# EasyEDA Pro project ovo.epro, board 114514
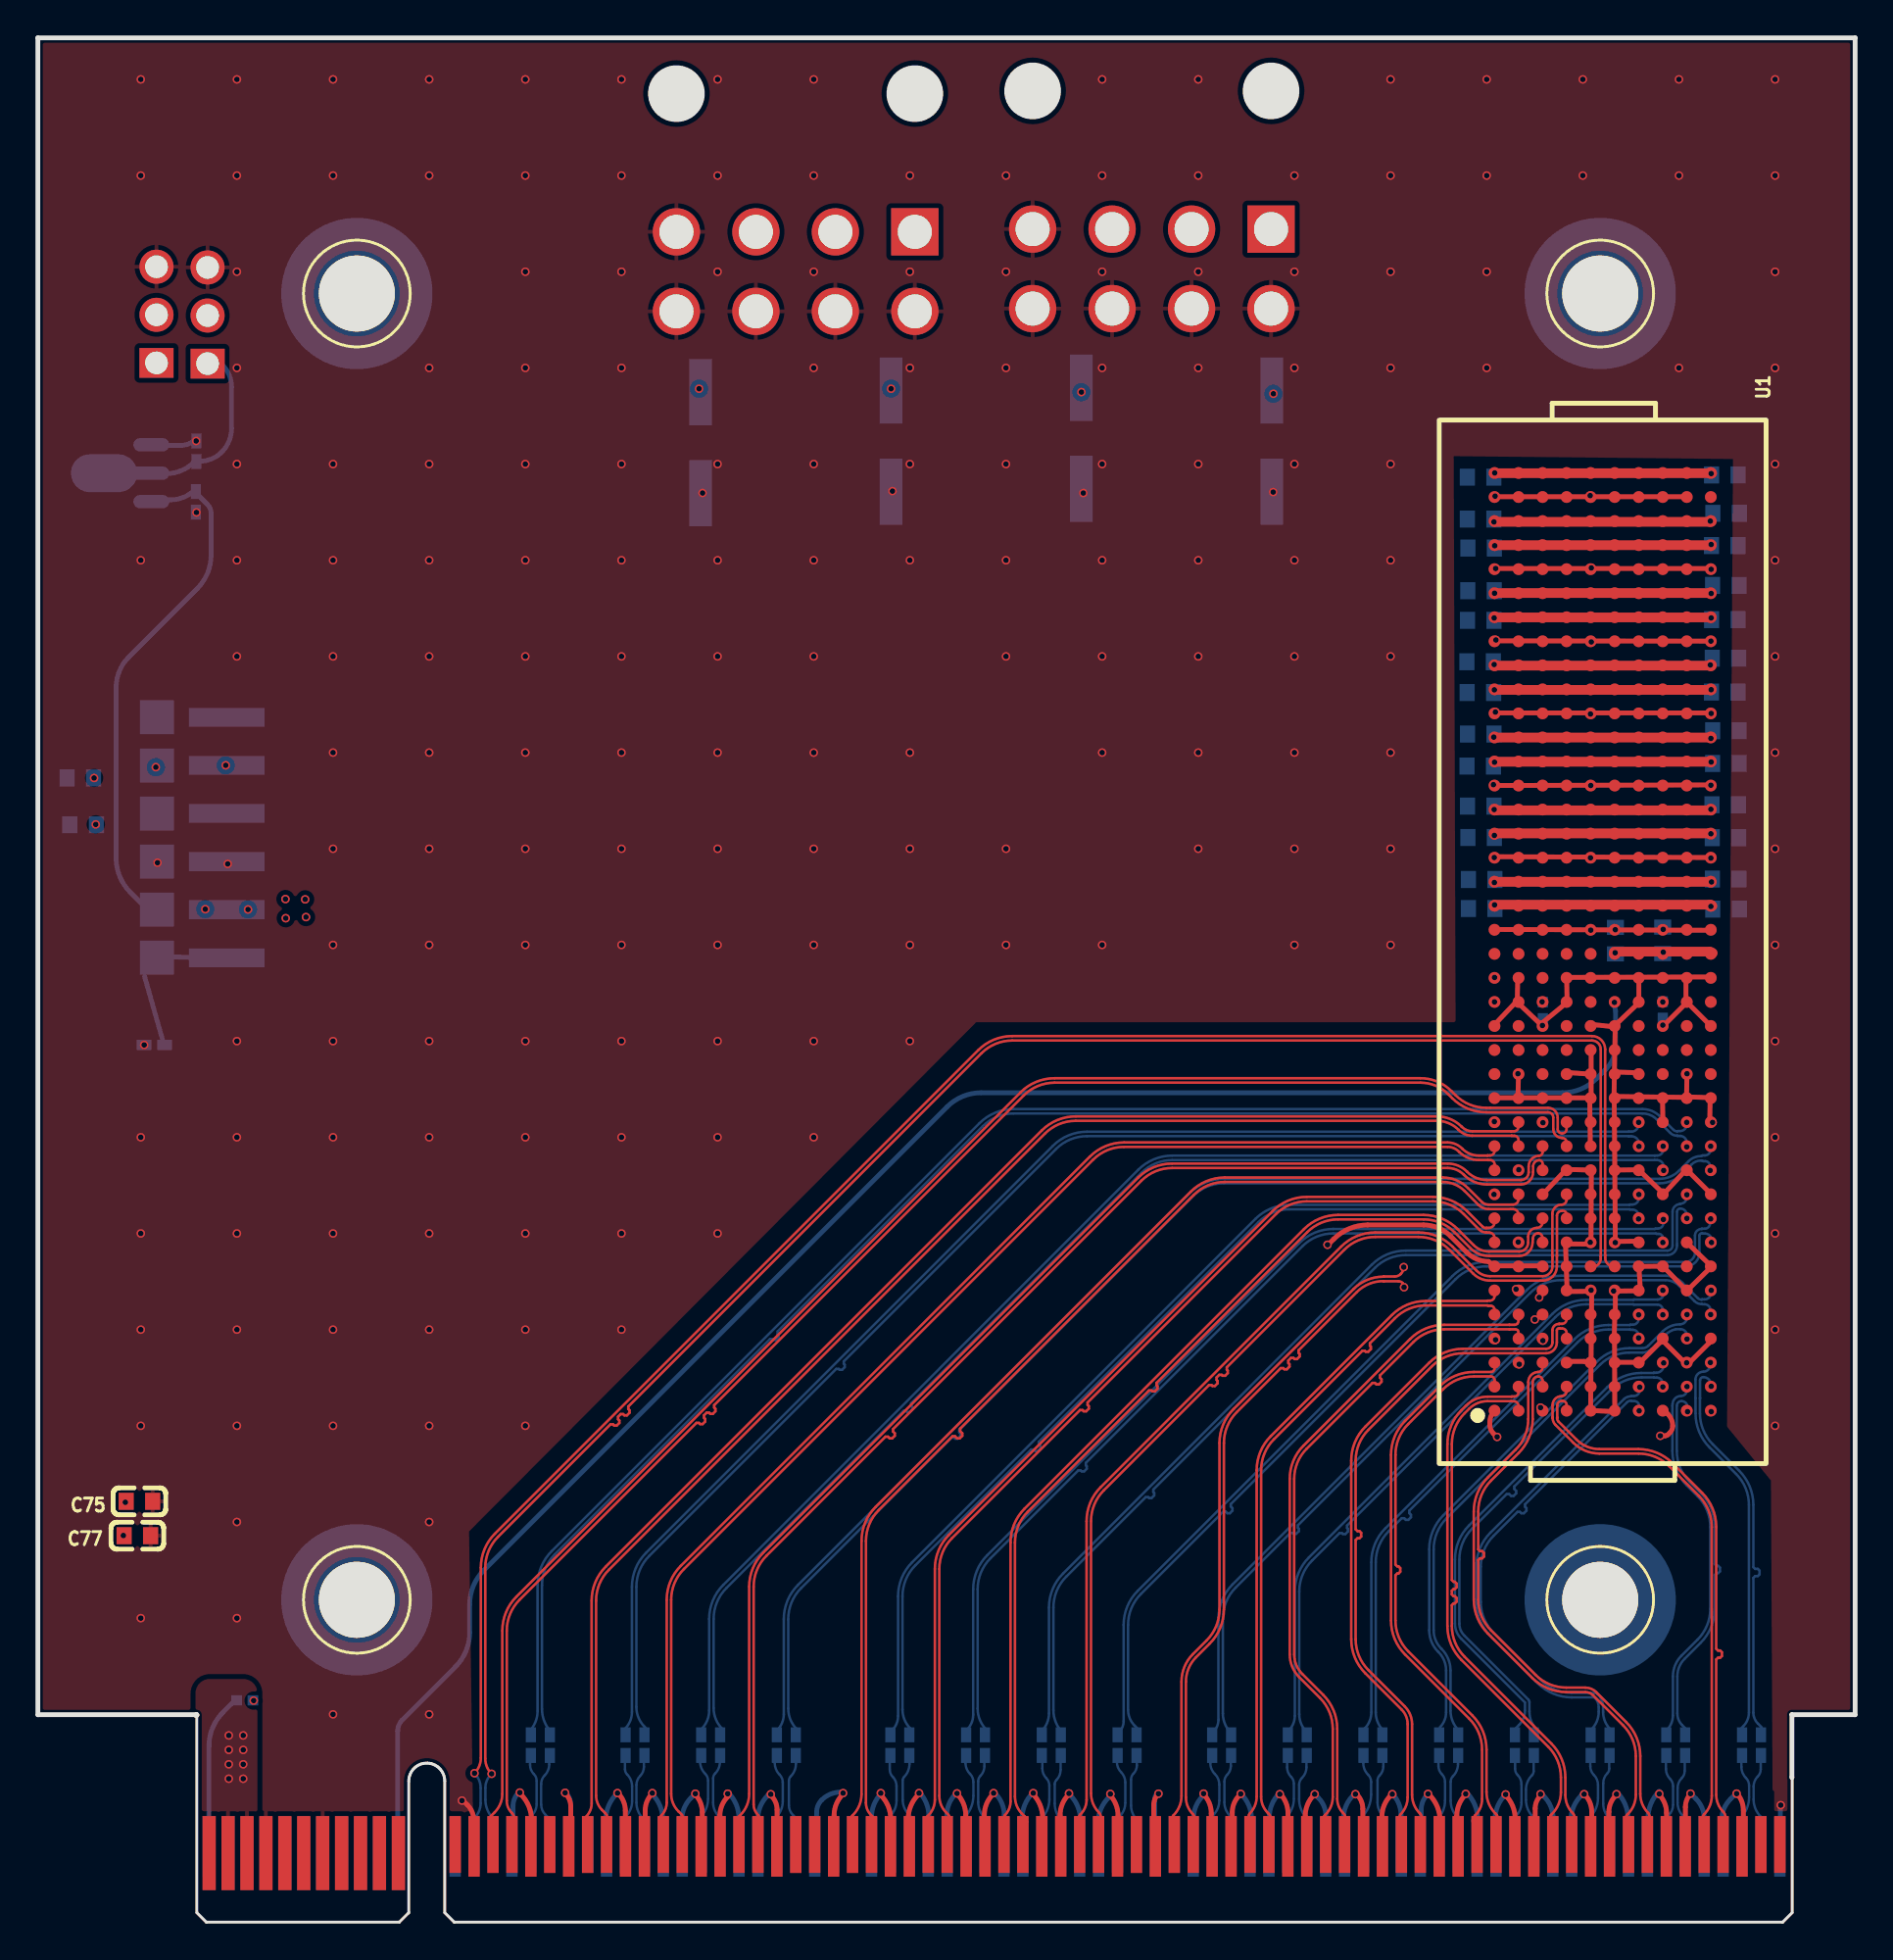
[diagram p0: board, top side]
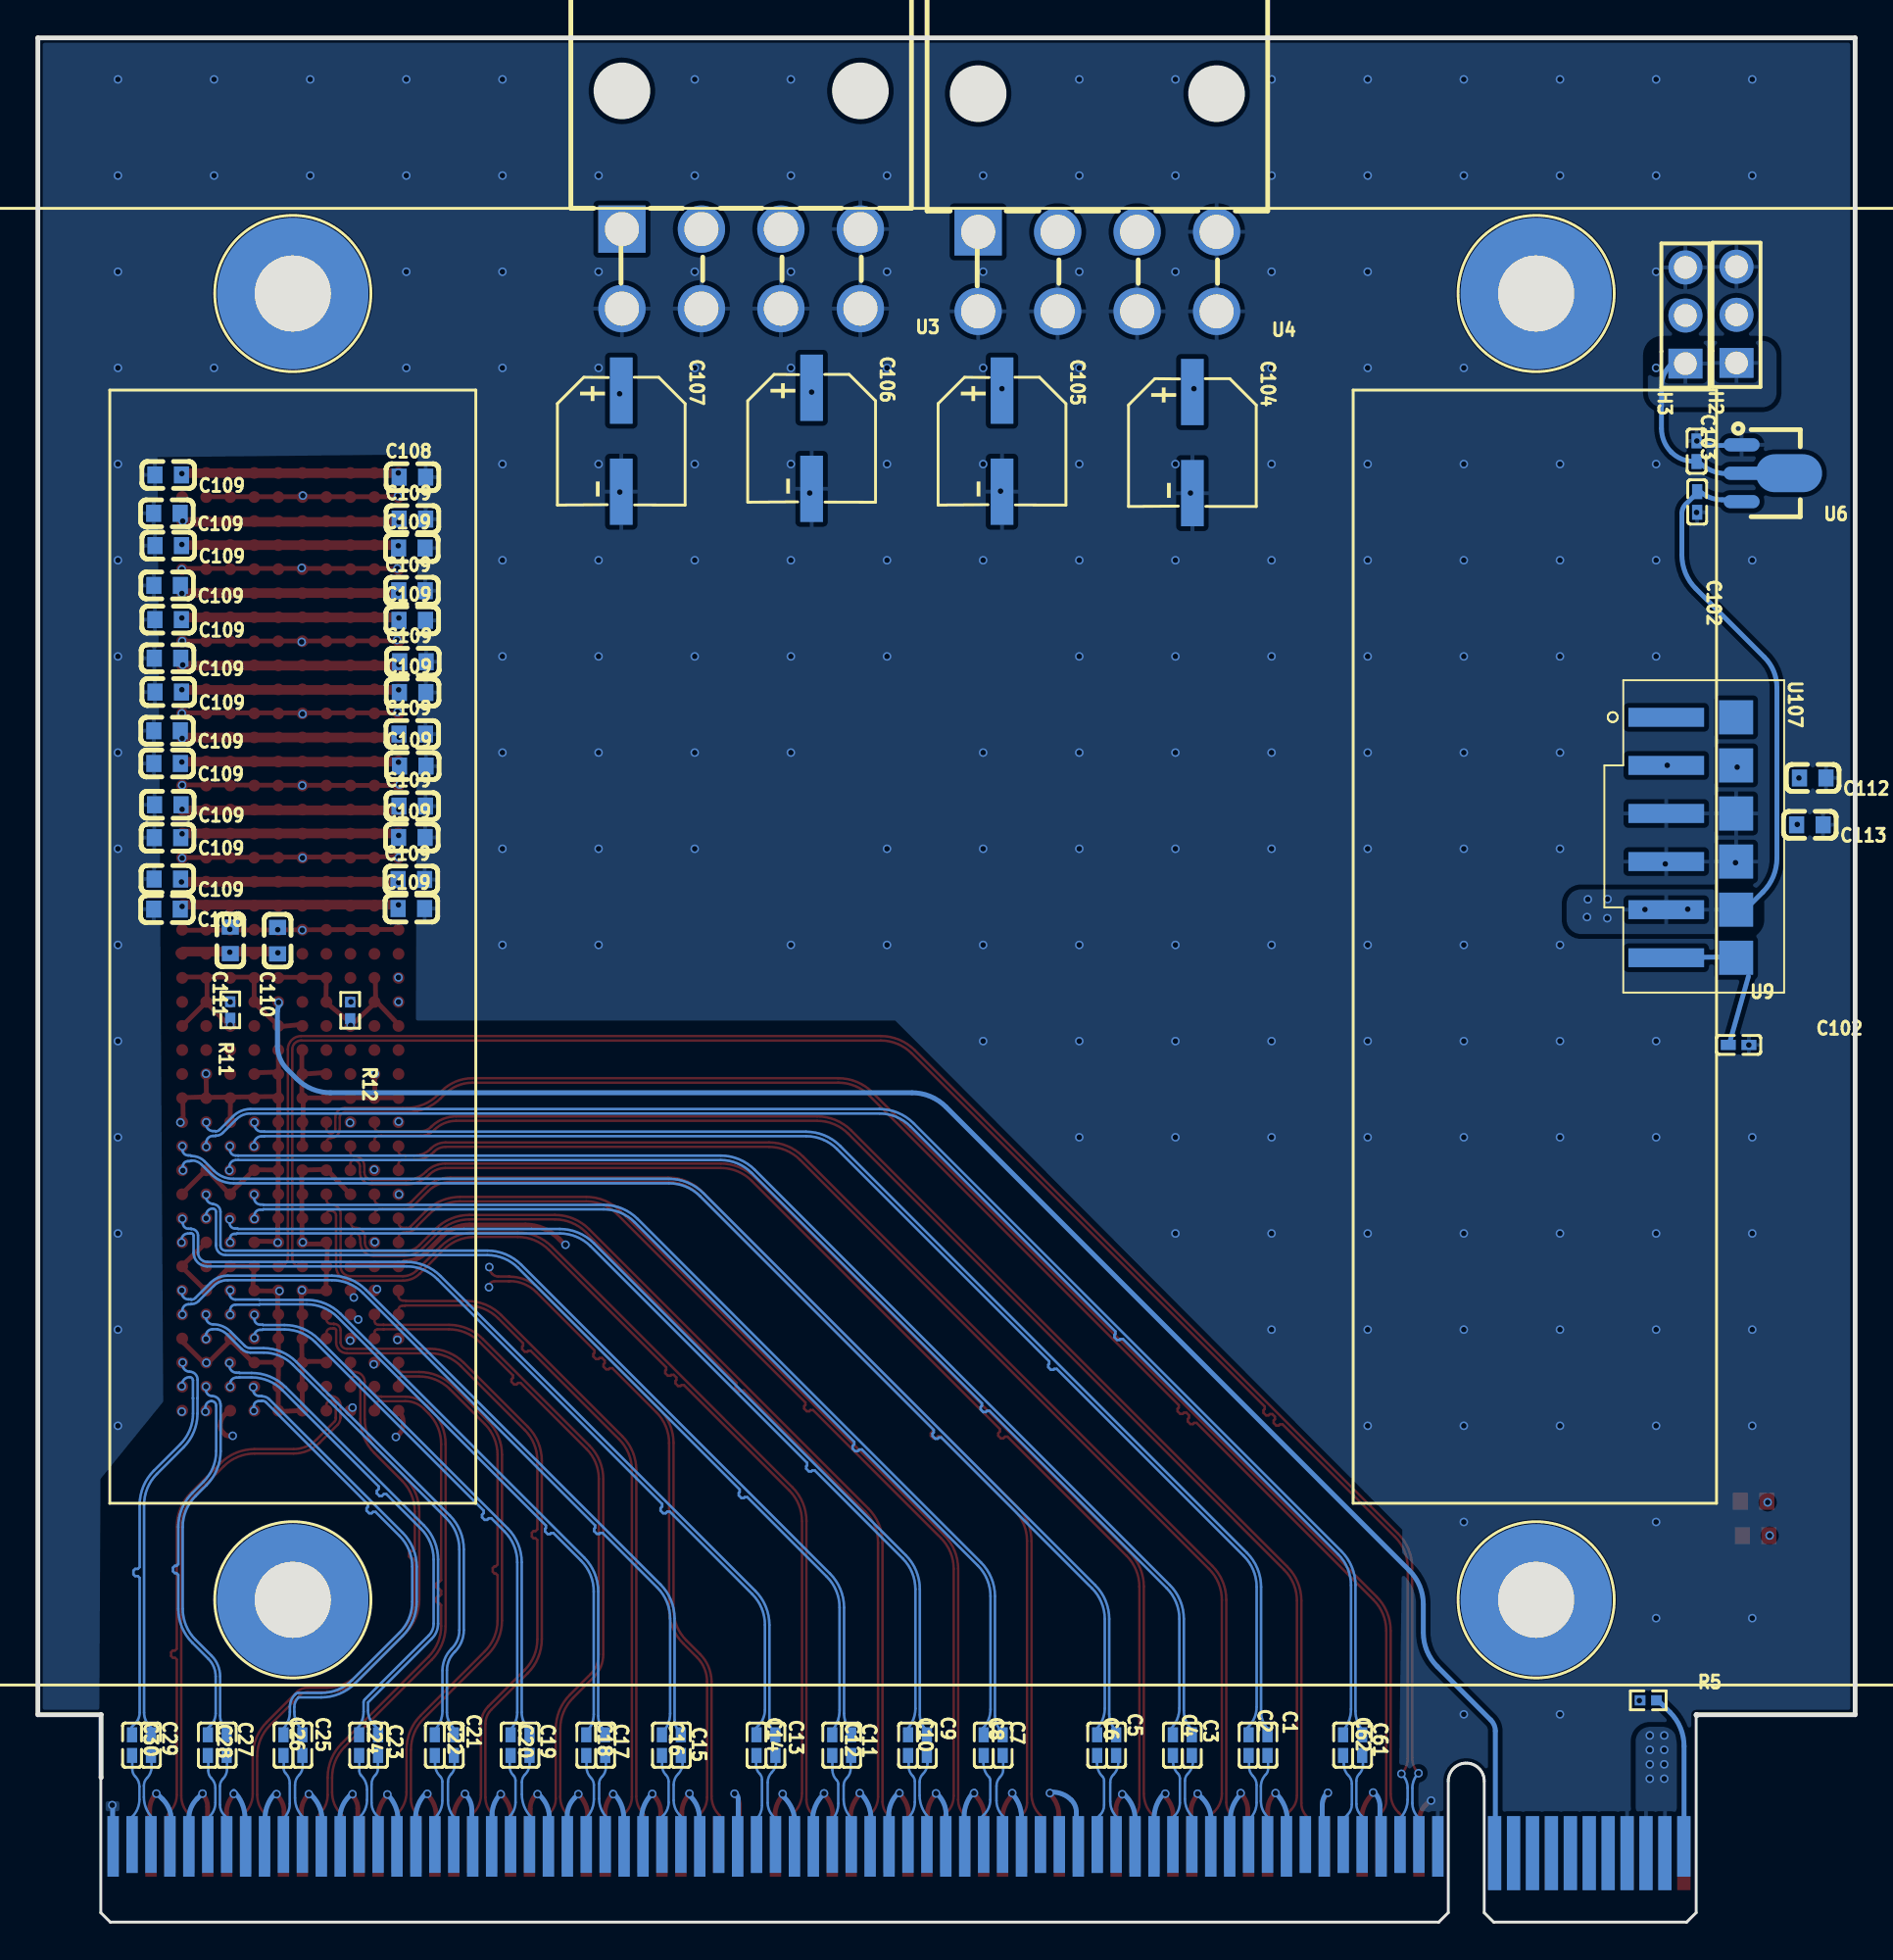
[diagram p1: board, bottom side, seen from below]

Outline 96.03 x 99.53 mm; copper layers: Top Layer, Inner1, Inner2, Inner3, 内层4, Bottom Layer. Coordinates in mm from the lower left corner of the outline.
Outline path: 8.34,10.96 8.34,10.93 8.4,10.93 8.4,10.96 0,10.96 0,99.53 96.03,99.53 96.03,10.96 92.69,10.96 ; 92.69,10.96 92.69,10.96 ; 92.69,10.96 92.69,7.65 92.69,7.65
Stack: Top Layer 0.035mm / Dielectric1 1.51mm FR4 er 4.5 / Inner1 0.035mm / Dielectric2 0.274mm FR4 er 4.5 / Inner2 0.035mm / Dielectric3 0.274mm PP er 4.5 / Inner3 0.035mm / Dielectric4 0.274mm PP er 4.5 / 内层4 0.035mm / Dielectric5 0.274mm PP er 4.5 / Bottom Layer 0.035mm

## Design rules (mm)
net CLK+: DP1
net CLK-: DP1
net RX0-: DP2
net RX15+: DP17
net RX15-: DP17
net RX11-: DP13
net RX7-: DP9
net RX0+: DP2
net RX7+: DP9
net RX11+: DP13
net RX14-: DP16
net RX14+: DP16
net RX6-: DP8
net RX3+: DP5
net RX3-: DP5
net RX6+: DP8
net RX10-: DP12
net RX4-: DP6
net RX13+: DP15
net RX13-: DP15
net RX1-: DP3
net RX1+: DP3
net RX4+: DP6
net RX10+: DP12
net RX2+: DP4
net RX2-: DP4
net RX9-: DP11
net RX12+: DP14
net RX9+: DP11
net RX12-: DP14
net RX5-: DP7
net RX5+: DP7
net RX8+: DP10
net RX8-: DP10
net TX8-: DP26
net TX3+: DP21
net TX15+: DP33
net TX7+: DP25
net TX8+: DP26
net TX3-: DP21
net TX7-: DP25
net TX15-: DP33
net TX0-: DP18
net TX11+: DP29
net TX14-: DP32
net TX0+: DP18
net TX6-: DP24
net TX6+: DP24
net TX11-: DP29
net TX14+: DP32
net TX2-: DP20
net TX2+: DP20
net TX5-: DP23
net TX12+: DP30
net TX12-: DP30
net TX9+: DP27
net TX9-: DP27
net TX5+: DP23
net TX1-: DP19
net TX1+: DP19
net TX4-: DP22
net TX10+: DP28
net TX13-: DP31
net TX4+: DP22
net TX10-: DP28
net TX13+: DP31
template: 自定义配置
spacing copperThickness1oz (default): track to track 0.102, other pairs 0.102 to 0.3
spacing copperThickness2oz: track to track 0.203, other pairs 0.152 to 0.3
track width copperThickness1oz (default): min 0.127, default 0.254, max 2.54
track width copperThickness2oz: min 0.203, default 0.254, max 2.54
differential pair differentialPair (default): width min 0.127, default 0.132, max 2.54; gap min 0.102, default 0.102
via viaSize (default): diameter min 0.254, default 0.45, max 10; hole min 0.254, default 0.3, max 6.3

## Placement (name value [footprint] x y rotation side)
C1  220nF  [C0402]  31.05 9.35 90 bottom
C2  220nF  [C0402]  32.05 9.35 90 bottom
C3  220nF  [C0402]  35.05 9.35 90 bottom
C4  220nF  [C0402]  36.05 9.35 90 bottom
C5  220nF  [C0402]  39.05 9.35 90 bottom
C6  220nF  [C0402]  40.05 9.35 90 bottom
C7  220nF  [C0402]  45.05 9.35 90 bottom
C8  220nF  [C0402]  46.05 9.35 90 bottom
C9  220nF  [C0402]  49.05 9.35 90 bottom
C10  220nF  [C0402]  50.05 9.35 90 bottom
C11  220nF  [C0402]  53.05 9.35 90 bottom
C12  220nF  [C0402]  54.05 9.35 90 bottom
C13  220nF  [C0402]  57.06 9.35 90 bottom
C14  220nF  [C0402]  58.06 9.35 90 bottom
C15  220nF  [C0402]  62.05 9.35 90 bottom
C16  220nF  [C0402]  63.05 9.35 90 bottom
C17  220nF  [C0402]  66.05 9.35 90 bottom
C18  220nF  [C0402]  67.05 9.35 90 bottom
C19  220nF  [C0402]  70.05 9.35 90 bottom
C20  220nF  [C0402]  71.05 9.35 90 bottom
C21  220nF  [C0402]  74.05 9.35 90 bottom
C22  220nF  [C0402]  75.05 9.35 90 bottom
C23  220nF  [C0402]  78.05 9.35 90 bottom
C24  220nF  [C0402]  79.05 9.35 90 bottom
C25  220nF  [C0402]  82.05 9.35 90 bottom
C26  220nF  [C0402]  83.05 9.35 90 bottom
C27  220nF  [C0402]  86.05 9.35 90 bottom
C28  220nF  [C0402]  87.05 9.35 90 bottom
C29  220nF  [C0402]  90.05 9.35 90 bottom
C30  220nF  [C0402]  91.05 9.35 90 bottom
C61  220nF  [C0402]  26.05 9.35 90 bottom
C62  220nF  [C0402]  27.06 9.35 90 bottom
C75  10uF  [C0603]  5.37 22.23 0 top
C77  10uF  [C0603]  5.26 20.41 0 top
C102  -  [C0402]  6.16 46.34 0 bottom
C102#2  -  [C0402]  8.35 75.02 90 bottom
C103  100nF  [C0402]  8.38 77.7 270 bottom
C104  470uF  [CAP-SMD_BD6.3-L6.6-W6.6-LS7.6-RD]  35.02 78.15 270 bottom
C105  470uF  [CAP-SMD_BD6.3-L6.6-W6.6-LS7.6-RD]  45.08 78.23 270 bottom
C106  470uF  [CAP-SMD_BD6.3-L6.6-W6.6-LS7.6-RD]  55.14 78.38 270 bottom
C107  470uF  [CAP-SMD_BD6.3-L6.6-W6.6-LS7.6-RD]  65.2 78.23 270 bottom
C108  -  [C0603]  89.21 53.51 0 bottom
C108#2  -  [C0603]  76.24 76.33 180 bottom
C109  -  [C0603]  89.14 76.44 0 bottom
C109#2  -  [C0603]  89.21 74.42 0 bottom
C109#3  -  [C0603]  89.14 72.71 0 bottom
C109#4  -  [C0603]  89.2 70.61 0 bottom
C109#5  -  [C0603]  89.14 68.8 0 bottom
C109#6  -  [C0603]  89.18 66.76 0 bottom
C109#7  -  [C0603]  89.14 64.97 0 bottom
C109#8  -  [C0603]  89.2 62.93 0 bottom
C109#9  -  [C0603]  89.2 61.2 0 bottom
C109#10  -  [C0603]  89.16 59.02 0 bottom
C109#11  -  [C0603]  89.18 57.28 0 bottom
C109#12  -  [C0603]  89.19 55.1 0 bottom
C109#13  -  [C0603]  76.24 74.11 180 bottom
C109#14  -  [C0603]  76.27 72.58 180 bottom
C109#15  -  [C0603]  76.26 70.33 180 bottom
C109#16  -  [C0603]  76.25 68.76 180 bottom
C109#17  -  [C0603]  76.21 66.58 180 bottom
C109#18  -  [C0603]  76.23 64.95 180 bottom
C109#19  -  [C0603]  76.25 62.76 180 bottom
C109#20  -  [C0603]  76.22 61.07 180 bottom
C109#21  -  [C0603]  76.25 58.95 180 bottom
C109#22  -  [C0603]  76.27 57.29 180 bottom
C109#23  -  [C0603]  76.29 55.07 180 bottom
C109#24  -  [C0603]  76.29 53.54 180 bottom
C110  100nF  [C0603]  83.36 51.84 90 bottom
C111  100nF  [C0603]  85.86 51.86 90 bottom
C112  100nF  [C0603]  2.24 60.44 0 bottom
C113  100nF  [C0603]  2.39 57.96 0 bottom
F1  -  [Gold Finger CEM GEN5x16]  50.91 12.95 0 top
H2  2.54-1*3P针  [HDR-TH_3P-P2.54-V-M-1]  6.27 84.9 90 bottom
H3  2.54-1*3P针  [HDR-TH_3P-P2.54-V-M-1]  8.97 84.86 90 bottom
R5  0Ω  [R0402]  10.93 11.72 0 bottom
R11  100Ω  [R0402]  85.86 48.19 270 bottom
R12  100Ω  [R0402]  79.53 48.16 270 bottom
U1  84740-102LF  [CONN-SMD_400P-P1.27_84740-002LF]  82.69 51.78 270 top
U3  X9357WR-2x04EH-LPSW  [CONN-TH_8P-P4.20_XKB_X9357WR-2X04EH-N2SW]  58.87 87.33 0 bottom
U4  X9357WR-2x04EH-LPSW  [CONN-TH_8P-P4.20_XKB_X9357WR-2X04EH-N2SW]  40.04 87.18 0 bottom
U6  AMS1117-1.8V  [SOT-89-3_L4.5-W2.5-P1.50-LS4.1-BR]  4.75 76.53 0 bottom
U9  -  [module_sxm2]  49.71 51.53 0 bottom
U107  U107  [ZXDN10S1205SAW-NEWs]  8.83 58.56 270 bottom

## Footprints (pads in the part's own frame, mm; a bottom-side part is the same pattern mirrored in y, then rotated)
C0402
  rect 0.79x0.54 smd: 1(-0.545,0) 2(0.545,0)
C0603
  rect 0.8x0.9 smd: 1(-0.7,0) 2(0.7,0)
CAP-SMD_BD6.3-L6.6-W6.6-LS7.6-RD
  rect 3.5x1.2 smd: 1(-2.67,0) 2(2.67,0)
CONN-SMD_400P-P1.27_84740-002LF
  round 0.623 smd: A1(24.765,-5.715) A2(23.495,-5.715) A3(22.225,-5.715) A4(20.955,-5.715) A5(19.685,-5.715) A6(18.415,-5.715) A7(17.145,-5.715) A8(15.875,-5.715) A9(14.605,-5.715) A10(13.335,-5.715) A11(12.065,-5.715) A12(10.795,-5.715) A13(9.525,-5.715) A14(8.255,-5.715) A15(6.985,-5.715) A16(5.715,-5.715) A17(4.445,-5.715) A18(3.175,-5.715) A19(1.905,-5.715) A20(0.635,-5.715) A21(-0.635,-5.715) A22(-1.905,-5.715) A23(-3.175,-5.715) A24(-4.445,-5.715) A25(-5.715,-5.715) A26(-6.985,-5.715) A27(-8.255,-5.715) A28(-9.525,-5.715) A29(-10.795,-5.715) A30(-12.065,-5.715) A31(-13.335,-5.715) A32(-14.605,-5.715) A33(-15.875,-5.715) A34(-17.145,-5.715) A35(-18.415,-5.715) A36(-19.685,-5.715) A37(-20.955,-5.715) A38(-22.225,-5.715) A39(-23.495,-5.715) A40(-24.765,-5.715) B1(24.765,-4.445) B2(23.495,-4.445) B3(22.225,-4.445) B4(20.955,-4.445) B5(19.685,-4.445) B6(18.415,-4.445) B7(17.145,-4.445) B8(15.875,-4.445) B9(14.605,-4.445) B10(13.335,-4.445) B11(12.065,-4.445) B12(10.795,-4.445) B13(9.525,-4.445) B14(8.255,-4.445) B15(6.985,-4.445) B16(5.715,-4.445) B17(4.445,-4.445) B18(3.175,-4.445) B19(1.905,-4.445) B20(0.635,-4.445) B21(-0.635,-4.445) B22(-1.905,-4.445) B23(-3.175,-4.445) B24(-4.445,-4.445) B25(-5.715,-4.445) B26(-6.985,-4.445) B27(-8.255,-4.445) B28(-9.525,-4.445) B29(-10.795,-4.445) B30(-12.065,-4.445) B31(-13.335,-4.445) B32(-14.605,-4.445) B33(-15.875,-4.445) B34(-17.145,-4.445) B35(-18.415,-4.445) B36(-19.685,-4.445) B37(-20.955,-4.445) B38(-22.225,-4.445) B39(-23.495,-4.445) B40(-24.765,-4.445) C1(24.765,-3.175) C2(23.495,-3.175) C3(22.225,-3.175) C4(20.955,-3.175) C5(19.685,-3.175) C6(18.415,-3.175) C7(17.145,-3.175) C8(15.875,-3.175) C9(14.605,-3.175) C10(13.335,-3.175) C11(12.065,-3.175) C12(10.795,-3.175) C13(9.525,-3.175) C14(8.255,-3.175) C15(6.985,-3.175) C16(5.715,-3.175) C17(4.445,-3.175) C18(3.175,-3.175) C19(1.905,-3.175) C20(0.635,-3.175) C21(-0.635,-3.175) C22(-1.905,-3.175) C23(-3.175,-3.175) C24(-4.445,-3.175) C25(-5.715,-3.175) C26(-6.985,-3.175) C27(-8.255,-3.175) C28(-9.525,-3.175) C29(-10.795,-3.175) C30(-12.065,-3.175) C31(-13.335,-3.175) C32(-14.605,-3.175) C33(-15.875,-3.175) C34(-17.145,-3.175) C35(-18.415,-3.175) C36(-19.685,-3.175) C37(-20.955,-3.175) C38(-22.225,-3.175) C39(-23.495,-3.175) C40(-24.765,-3.175) D1(24.765,-1.905) D2(23.495,-1.905) D3(22.225,-1.905) D4(20.955,-1.905) D5(19.685,-1.905) D6(18.415,-1.905) D7(17.145,-1.905) D8(15.875,-1.905) D9(14.605,-1.905) D10(13.335,-1.905) D11(12.065,-1.905) D12(10.795,-1.905) D13(9.525,-1.905) D14(8.255,-1.905) D15(6.985,-1.905) D16(5.715,-1.905) D17(4.445,-1.905) D18(3.175,-1.905) D19(1.905,-1.905) D20(0.635,-1.905) D21(-0.635,-1.905) D22(-1.905,-1.905) D23(-3.175,-1.905) D24(-4.445,-1.905) D25(-5.715,-1.905) D26(-6.985,-1.905) D27(-8.255,-1.905) D28(-9.525,-1.905) D29(-10.795,-1.905) D30(-12.065,-1.905) D31(-13.335,-1.905) D32(-14.605,-1.905) D33(-15.875,-1.905) D34(-17.145,-1.905) D35(-18.415,-1.905) D36(-19.685,-1.905) D37(-20.955,-1.905) D38(-22.225,-1.905) D39(-23.495,-1.905) D40(-24.765,-1.905) E1(24.765,-0.635) E2(23.495,-0.635) E3(22.225,-0.635) E4(20.955,-0.635) E5(19.685,-0.635) E6(18.415,-0.635) E7(17.145,-0.635) E8(15.875,-0.635) E9(14.605,-0.635) E10(13.335,-0.635) E11(12.065,-0.635) E12(10.795,-0.635) E13(9.525,-0.635) E14(8.255,-0.635) E15(6.985,-0.635) E16(5.715,-0.635) E17(4.445,-0.635) E18(3.175,-0.635) E19(1.905,-0.635) E20(0.635,-0.635) E21(-0.635,-0.635) E22(-1.905,-0.635) E23(-3.175,-0.635) E24(-4.445,-0.635) E25(-5.715,-0.635) E26(-6.985,-0.635) E27(-8.255,-0.635) E28(-9.525,-0.635) E29(-10.795,-0.635) E30(-12.065,-0.635) E31(-13.335,-0.635) E32(-14.605,-0.635) E33(-15.875,-0.635) E34(-17.145,-0.635) E35(-18.415,-0.635) E36(-19.685,-0.635) E37(-20.955,-0.635) E38(-22.225,-0.635) E39(-23.495,-0.635) E40(-24.765,-0.635) F1(24.765,0.635) F2(23.495,0.635) F3(22.225,0.635) F4(20.955,0.635) F5(19.685,0.635) F6(18.415,0.635) F7(17.145,0.635) F8(15.875,0.635) F9(14.605,0.635) F10(13.335,0.635) F11(12.065,0.635) F12(10.795,0.635) F13(9.525,0.635) F14(8.255,0.635) F15(6.985,0.635) F16(5.715,0.635) F17(4.445,0.635) F18(3.175,0.635) F19(1.905,0.635) F20(0.635,0.635) F21(-0.635,0.635) F22(-1.905,0.635) F23(-3.175,0.635) F24(-4.445,0.635) F25(-5.715,0.635) F26(-6.985,0.635) F27(-8.255,0.635) F28(-9.525,0.635) F29(-10.795,0.635) F30(-12.065,0.635) F31(-13.335,0.635) F32(-14.605,0.635) F33(-15.875,0.635) F34(-17.145,0.635) F35(-18.415,0.635) F36(-19.685,0.635) F37(-20.955,0.635) F38(-22.225,0.635) F39(-23.495,0.635) F40(-24.765,0.635) G1(24.765,1.905) G2(23.495,1.905) G3(22.225,1.905) G4(20.955,1.905) G5(19.685,1.905) G6(18.415,1.905) G7(17.145,1.905) G8(15.875,1.905) G9(14.605,1.905) G10(13.335,1.905) G11(12.065,1.905) G12(10.795,1.905) G13(9.525,1.905) G14(8.255,1.905) G15(6.985,1.905) G16(5.715,1.905) G17(4.445,1.905) G18(3.175,1.905) G19(1.905,1.905) G20(0.635,1.905) G21(-0.635,1.905) G22(-1.905,1.905) G23(-3.175,1.905) G24(-4.445,1.905) G25(-5.715,1.905) G26(-6.985,1.905) G27(-8.255,1.905) G28(-9.525,1.905) G29(-10.795,1.905) G30(-12.065,1.905) G31(-13.335,1.905) G32(-14.605,1.905) G33(-15.875,1.905) G34(-17.145,1.905) G35(-18.415,1.905) G36(-19.685,1.905) G37(-20.955,1.905) G38(-22.225,1.905) G39(-23.495,1.905) G40(-24.765,1.905) H1(24.765,3.175) H2(23.495,3.175) H3(22.225,3.175) H4(20.955,3.175) H5(19.685,3.175) H6(18.415,3.175) H7(17.145,3.175) H8(15.875,3.175) H9(14.605,3.175) H10(13.335,3.175) H11(12.065,3.175) H12(10.795,3.175) H13(9.525,3.175) H14(8.255,3.175) H15(6.985,3.175) H16(5.715,3.175) H17(4.445,3.175) H18(3.175,3.175) H19(1.905,3.175) H20(0.635,3.175) H21(-0.635,3.175) H22(-1.905,3.175) H23(-3.175,3.175) H24(-4.445,3.175) H25(-5.715,3.175) H26(-6.985,3.175) H27(-8.255,3.175) H28(-9.525,3.175) H29(-10.795,3.175) H30(-12.065,3.175) H31(-13.335,3.175) H32(-14.605,3.175) H33(-15.875,3.175) H34(-17.145,3.175) H35(-18.415,3.175) H36(-19.685,3.175) H37(-20.955,3.175) H38(-22.225,3.175) H39(-23.495,3.175) H40(-24.765,3.175) J1(24.765,4.445) J2(23.495,4.445) J3(22.225,4.445) J4(20.955,4.445) J5(19.685,4.445) J6(18.415,4.445) J7(17.145,4.445) J8(15.875,4.445) J9(14.605,4.445) J10(13.335,4.445) J11(12.065,4.445) J12(10.795,4.445) J13(9.525,4.445) J14(8.255,4.445) J15(6.985,4.445) J16(5.715,4.445) J17(4.445,4.445) J18(3.175,4.445) J19(1.905,4.445) J20(0.635,4.445) J21(-0.635,4.445) J22(-1.905,4.445) J23(-3.175,4.445) J24(-4.445,4.445) J25(-5.715,4.445) J26(-6.985,4.445) J27(-8.255,4.445) J28(-9.525,4.445) J29(-10.795,4.445) J30(-12.065,4.445) J31(-13.335,4.445) J32(-14.605,4.445) J33(-15.875,4.445) J34(-17.145,4.445) J35(-18.415,4.445) J36(-19.685,4.445) J37(-20.955,4.445) J38(-22.225,4.445) J39(-23.495,4.445) J40(-24.765,4.445) K1(24.765,5.715) K2(23.495,5.715) K3(22.225,5.715) K4(20.955,5.715) K5(19.685,5.715) K6(18.415,5.715) K7(17.145,5.715) K8(15.875,5.715) K9(14.605,5.715) K10(13.335,5.715) K11(12.065,5.715) K12(10.795,5.715) K13(9.525,5.715) K14(8.255,5.715) K15(6.985,5.715) K16(5.715,5.715) K17(4.445,5.715) K18(3.175,5.715) K19(1.905,5.715) K20(0.635,5.715) K21(-0.635,5.715) K22(-1.905,5.715) K23(-3.175,5.715) K24(-4.445,5.715) K25(-5.715,5.715) K26(-6.985,5.715) K27(-8.255,5.715) K28(-9.525,5.715) K29(-10.795,5.715) K30(-12.065,5.715) K31(-13.335,5.715) K32(-14.605,5.715) K33(-15.875,5.715) K34(-17.145,5.715) K35(-18.415,5.715) K36(-19.685,5.715) K37(-20.955,5.715) K38(-22.225,5.715) K39(-23.495,5.715) K40(-24.765,5.715)
CONN-TH_8P-P4.20_XKB_X9357WR-2X04EH-N2SW
  rect 2.5x2.5 hole 1.8: 1(6.3,-2.1)
  round 2.5 hole 1.8: 2(2.1,-2.1) 3(-2.1,-2.1) 4(-6.3,-2.1) 5(6.3,2.1) 6(2.1,2.1) 7(-2.1,2.1) 8(-6.3,2.1)
Gold Finger CEM GEN5x16
  rect 0.7x3.2 smd far side: A1(-41.858,-8.949)
  rect 0.7x3.91 smd far side: A2(-40.858,-9.304) A3(-39.858,-9.304) A4(-38.858,-9.304) A5(-37.858,-9.304) A6(-36.858,-9.304) A7(-35.858,-9.304) A8(-34.858,-9.304) A9(-33.858,-9.304) A10(-32.858,-9.304) A11(-31.858,-9.304)
  rect 0.6x3.2 smd far side: A12(-28.858,-8.949) A15(-25.858,-8.949) A18(-22.858,-8.949) A20(-20.858,-8.949) A23(-17.858,-8.949) A24(-16.858,-8.949) A27(-13.858,-8.949) A28(-12.858,-8.949) A31(-9.858,-8.949) A34(-6.858,-8.949) A37(-3.858,-8.949) A38(-2.858,-8.949) A41(0.142,-8.949) A42(1.142,-8.949) A45(4.142,-8.949) A46(5.142,-8.949) A49(8.142,-8.949) A51(10.142,-8.949) A54(13.142,-8.949) A55(14.142,-8.949) A58(17.142,-8.949) A59(18.142,-8.949) A62(21.142,-8.949) A63(22.142,-8.949) A66(25.142,-8.949) A67(26.142,-8.949) A70(29.142,-8.949) A71(30.142,-8.949) A74(33.142,-8.949) A75(34.142,-8.949) A78(37.142,-8.949) A79(38.142,-8.949) A82(41.142,-8.949)
  rect 0.6x3 smd far side: A13(-27.858,-8.849) A14(-26.858,-8.849) A16(-24.858,-8.849) A17(-23.858,-8.849) A19(-21.858,-8.849) A21(-19.858,-8.849) A22(-18.858,-8.849) A25(-15.858,-8.849) A26(-14.858,-8.849) A29(-11.858,-8.849) A30(-10.858,-8.849) A32(-8.858,-8.849) A33(-7.858,-8.849) A35(-5.858,-8.849) A36(-4.858,-8.849) A39(-1.858,-8.849) A40(-0.858,-8.849) A43(2.142,-8.849) A44(3.142,-8.849) A47(6.142,-8.849) A48(7.142,-8.849) A50(9.142,-8.849) A52(11.142,-8.849) A53(12.142,-8.849) A56(15.142,-8.849) A57(16.142,-8.849) A60(19.142,-8.849) A61(20.142,-8.849) A64(23.142,-8.849) A65(24.142,-8.849) A68(27.142,-8.849) A69(28.142,-8.849) A72(31.142,-8.849) A73(32.142,-8.849) A76(35.142,-8.849) A77(36.142,-8.849) A80(39.142,-8.849) A81(40.142,-8.849)
  rect 0.7x3.91 smd: B1(-41.858,-9.304) B2(-40.858,-9.304) B3(-39.858,-9.304) B4(-38.858,-9.304) B5(-37.858,-9.304) B6(-36.858,-9.304) B7(-35.858,-9.304) B8(-34.858,-9.304) B9(-33.858,-9.304) B10(-32.858,-9.304) B11(-31.858,-9.304)
  rect 0.6x3 smd: B12(-28.858,-8.849) B14(-26.858,-8.849) B15(-25.858,-8.849) B17(-23.858,-8.849) B19(-21.858,-8.849) B20(-20.858,-8.849) B23(-17.858,-8.849) B24(-16.858,-8.849) B27(-13.858,-8.849) B28(-12.858,-8.849) B30(-10.858,-8.849) B31(-9.858,-8.849) B33(-7.858,-8.849) B34(-6.858,-8.849) B37(-3.858,-8.849) B38(-2.858,-8.849) B41(0.142,-8.849) B42(1.142,-8.849) B45(4.142,-8.849) B46(5.142,-8.849) B48(7.142,-8.849) B50(9.142,-8.849) B51(10.142,-8.849) B54(13.142,-8.849) B55(14.142,-8.849) B58(17.142,-8.849) B59(18.142,-8.849) B62(21.142,-8.849) B63(22.142,-8.849) B66(25.142,-8.849) B67(26.142,-8.849) B70(29.142,-8.849) B71(30.142,-8.849) B74(33.142,-8.849) B75(34.142,-8.849) B78(37.142,-8.849) B79(38.142,-8.849) B81(40.142,-8.849) B82(41.142,-8.849)
  rect 0.6x3.2 smd: B13(-27.858,-8.949) B16(-24.858,-8.949) B18(-22.858,-8.949) B21(-19.858,-8.949) B22(-18.858,-8.949) B25(-15.858,-8.949) B26(-14.858,-8.949) B29(-11.858,-8.949) B32(-8.858,-8.949) B35(-5.858,-8.949) B36(-4.858,-8.949) B39(-1.858,-8.949) B40(-0.858,-8.949) B43(2.142,-8.949) B44(3.142,-8.949) B47(6.142,-8.949) B49(8.142,-8.949) B52(11.142,-8.949) B53(12.142,-8.949) B56(15.142,-8.949) B57(16.142,-8.949) B60(19.142,-8.949) B61(20.142,-8.949) B64(23.142,-8.949) B65(24.142,-8.949) B68(27.142,-8.949) B69(28.142,-8.949) B72(31.142,-8.949) B73(32.142,-8.949) B76(35.142,-8.949) B77(36.142,-8.949) B80(39.142,-8.949)
HDR-TH_3P-P2.54-V-M-1
  rect 1.575x1.8 hole 1.2: 1(-2.54,0)
  round 1.8 hole 1.2: 2(0,0) 3(2.54,0)
module_sxm2
  round 4.013 hole 4.013: MH2(32.85,34.5) MH3(-32.85,34.5) MH6(32.85,-34.5) MH7(-32.85,-34.5)
R0402
  rect 0.566x0.54 smd: 1(-0.433,0) 2(0.433,0)
SOT-89-3_L4.5-W2.5-P1.50-LS4.1-BR
  oval 1.9x0.7 smd: 1(1.25,-1.501) 3(1.25,1.501)
  oval 3.5x2 smd: 2(-1.25,0)
  oval 2.1x0.7 smd: 2(1.151,0)
ZXDN10S1205SAW-NEWs
  rect 1x4 smd: 1(-5.08,-1.15) 2(-2.54,-1.15) 3(0,-1.15) 4(2.54,-1.15) 5(5.08,-1.15) 6(7.62,-1.15)
  rect 1.8x1.8 smd: 1(-5.08,2.54) 2(-2.54,2.54) 3(0,2.54) 4(2.54,2.54) 5(5.08,2.54) 6(7.62,2.54)

## Nets
+1V8: C103.2 H2.1 H3.1 U6.2
+3V3: F1.A9 F1.A10 F1.B8
+5V: C102#2.2 C110.1 C111.1 U1.F20 U1.G20 U1.H20 U1.J20 U1.K20 U6.3 U107.5
+12V: C75.1 C77.1 C104.1 C105.1 C106.1 C107.1 C108.1 C108#2.1 C109.1 C109#2.1 C109#3.1 C109#4.1 C109#5.1 C109#6.1 C109#7.1 C109#8.1 C109#9.1 C109#10.1 C109#11.1 C109#12.1 C109#13.1 C109#14.1 C109#15.1 C109#16.1 C109#17.1 C109#18.1 C109#19.1 C109#20.1 C109#21.1 C109#22.1 C109#23.1 C109#24.1 C112.2 C113.2 F1.A2 F1.A3 F1.B1 F1.B2 F1.B3 U1.A22 U1.A23 U1.A25 U1.A26 U1.A28 U1.A29 U1.A31 U1.A32 U1.A34 U1.A35 U1.A37 U1.A38 U1.A40 U1.B22 U1.B23 U1.B25 U1.B26 U1.B28 U1.B29 U1.B31 U1.B32 U1.B34 U1.B35 U1.B37 U1.B38 U1.B40 U1.C22 U1.C23 U1.C25 U1.C26 U1.C28 U1.C29 U1.C31 U1.C32 U1.C34 U1.C35 U1.C37 U1.C38 U1.C40 U1.D22 U1.D23 U1.D25 U1.D26 U1.D28 U1.D29 U1.D31 U1.D32 U1.D34 U1.D35 U1.D37 U1.D38 U1.D40 U1.E22 U1.E23 U1.E25 U1.E26 U1.E28 U1.E29 U1.E31 U1.E32 U1.E34 U1.E35 U1.E37 U1.E38 U1.E40 U1.F22 U1.F23 U1.F25 U1.F26 U1.F28 U1.F29 U1.F31 U1.F32 U1.F34 U1.F35 U1.F37 U1.F38 U1.F40 U1.G22 U1.G23 U1.G25 U1.G26 U1.G28 U1.G29 U1.G31 U1.G32 U1.G34 U1.G35 U1.G37 U1.G38 U1.G40 U1.H22 U1.H23 U1.H25 U1.H26 U1.H28 U1.H29 U1.H31 U1.H32 U1.H34 U1.H35 U1.H37 U1.H38 U1.H40 U1.J22 U1.J23 U1.J25 U1.J26 U1.J28 U1.J29 U1.J31 U1.J32 U1.J34 U1.J35 U1.J37 U1.J38 U1.J40 U1.K22 U1.K23 U1.K25 U1.K26 U1.K28 U1.K29 U1.K31 U1.K32 U1.K34 U1.K35 U1.K37 U1.K38 U1.K40 U3.1 U3.2 U3.3 U4.1 U4.2 U4.3 U107.2
GND: C75.2 C77.2 C102.1 C102#2.1 C103.1 C104.2 C105.2 C106.2 C107.2 C108.2 C108#2.2 C109.2 C109#2.2 C109#3.2 C109#4.2 C109#5.2 C109#6.2 C109#7.2 C109#8.2 C109#9.2 C109#10.2 C109#11.2 C109#12.2 C109#13.2 C109#14.2 C109#15.2 C109#16.2 C109#17.2 C109#18.2 C109#19.2 C109#20.2 C109#21.2 C109#22.2 C109#23.2 C109#24.2 C110.2 C111.2 C112.1 C113.1 F1.A4 F1.A12 F1.A15 F1.A18 F1.A20 F1.A23 F1.A24 F1.A27 F1.A28 F1.A31 F1.A34 F1.A37 F1.A38 F1.A41 F1.A42 F1.A45 F1.A46 F1.A49 F1.A51 F1.A54 F1.A55 F1.A58 F1.A59 F1.A62 F1.A63 F1.A66 F1.A67 F1.A70 F1.A71 F1.A74 F1.A75 F1.A78 F1.A79 F1.A82 F1.B4 F1.B7 F1.B13 F1.B16 F1.B18 F1.B21 F1.B22 F1.B25 F1.B26 F1.B29 F1.B32 F1.B35 F1.B36 F1.B39 F1.B40 F1.B43 F1.B44 F1.B47 F1.B49 F1.B52 F1.B53 F1.B56 F1.B57 F1.B60 F1.B61 F1.B64 F1.B65 F1.B68 F1.B69 F1.B72 F1.B73 F1.B76 F1.B77 F1.B80 H2.3 H3.3 R11.2 R12.2 U1.A1 U1.A4 U1.A7 U1.A10 U1.A13 U1.A14 U1.A17 U1.A21 U1.A24 U1.A27 U1.A30 U1.A33 U1.A36 U1.A39 U1.B3 U1.B6 U1.B7 U1.B8 U1.B11 U1.B14 U1.B15 U1.B18 U1.B19 U1.B21 U1.B24 U1.B27 U1.B30 U1.B33 U1.B36 U1.B39 U1.C1 U1.C4 U1.C7 U1.C10 U1.C13 U1.C14 U1.C17 U1.C21 U1.C24 U1.C27 U1.C30 U1.C33 U1.C36 U1.C39 U1.D3 U1.D6 U1.D7 U1.D8 U1.D11 U1.D14 U1.D15 U1.D18 U1.D19 U1.D21 U1.D24 U1.D27 U1.D30 U1.D33 U1.D36 U1.D39 U1.E1 U1.E2 U1.E3 U1.E4 U1.E5 U1.E6 U1.E8 U1.E9 U1.E10 U1.E11 U1.E12 U1.E13 U1.E14 U1.E15 U1.E16 U1.E17 U1.E19 U1.E21 U1.E24 U1.E27 U1.E30 U1.E33 U1.E36 U1.E39 U1.F1 U1.F2 U1.F3 U1.F4 U1.F5 U1.F6 U1.F8 U1.F9 U1.F10 U1.F11 U1.F12 U1.F13 U1.F14 U1.F15 U1.F16 U1.F17 U1.F19 U1.F21 U1.F24 U1.F27 U1.F30 U1.F33 U1.F36 U1.F39 U1.G3 U1.G6 U1.G7 U1.G8 U1.G11 U1.G14 U1.G15 U1.G18 U1.G19 U1.G21 U1.G24 U1.G27 U1.G30 U1.G33 U1.G36 U1.G39 U1.H1 U1.H4 U1.H7 U1.H10 U1.H13 U1.H14 U1.H17 U1.H19 U1.H21 U1.H24 U1.H27 U1.H30 U1.H33 U1.H36 U1.H39 U1.J3 U1.J6 U1.J8 U1.J11 U1.J14 U1.J15 U1.J18 U1.J19 U1.J21 U1.J24 U1.J27 U1.J30 U1.J33 U1.J36 U1.J39 U1.K1 U1.K4 U1.K7 U1.K10 U1.K13 U1.K14 U1.K17 U1.K19 U1.K21 U1.K24 U1.K27 U1.K30 U1.K33 U1.K36 U3.4 U3.5 U3.6 U3.7 U3.8 U4.4 U4.5 U4.6 U4.7 U4.8 U6.1 U107.3 U107.4
ADJ: C102.2 U107.6
CLK+: F1.A13 U1.F7
CLK-: F1.A14 U1.E7
EN: U107.1
I2CADDR0: R11.1 U1.H18
I2CADDR1: R12.1 U1.C18
JTAG_SEL: U1.C19
JTAG_TCLK: U1.C20
JTAG_TDI: U1.E20
JTAG_TDO: U1.D20
JTAG_TMS: U1.B20
JTAG_TRST#: U1.A20
PCIET0+: C61.1 F1.A16
PCIET0-: C62.1 F1.A17
PCIET1+: C1.1 F1.A21
PCIET1-: C2.1 F1.A22
PCIET2+: C3.1 F1.A25
PCIET2-: C4.1 F1.A26
PCIET3+: C5.1 F1.A29
PCIET3-: C6.1 F1.A30
PCIET4+: C7.1 F1.A35
PCIET4-: C8.1 F1.A36
PCIET5+: C9.1 F1.A39
PCIET5-: C10.1 F1.A40
PCIET6+: C11.1 F1.A43
PCIET6-: C12.1 F1.A44
PCIET7+: C13.1 F1.A47
PCIET7-: C14.1 F1.A48
PCIET8+: C15.1 F1.A52
PCIET8-: C16.1 F1.A53
PCIET9+: C17.1 F1.A56
PCIET9-: C18.1 F1.A57
PCIET10+: C19.1 F1.A60
PCIET10-: C20.1 F1.A61
PCIET11+: C21.1 F1.A64
PCIET11-: C22.1 F1.A65
PCIET12+: C23.1 F1.A68
PCIET12-: C24.1 F1.A69
PCIET13+: C25.1 F1.A72
PCIET13-: C26.1 F1.A73
PCIET14+: C27.1 F1.A76
PCIET14-: C28.1 F1.A77
PCIET15+: C29.1 F1.A80
PCIET15-: C30.1 F1.A81
PERST#: F1.A11 U1.F18
PRSNT1: F1.A1 R5.1
PRSNT2: F1.B17 F1.B31 F1.B48 F1.B81 R5.2
PRSNT2#_SXM: U1.J7
PWR_BRAKE#: U1.E18
PWR_EN: H2.2 U1.A18
PWR_GOOD: U1.K18
RX0+: F1.B14 U1.D13
RX0-: F1.B15 U1.D12
RX1+: F1.B19 U1.B13
RX1-: F1.B20 U1.B12
RX2+: F1.B23 U1.A12
RX2-: F1.B24 U1.A11
RX3+: F1.B27 U1.C12
RX3-: F1.B28 U1.C11
RX4+: F1.B33 U1.B10
RX4-: F1.B34 U1.B9
RX5+: F1.B37 U1.A9
RX5-: F1.B38 U1.A8
RX6+: F1.B41 U1.C9
RX6-: F1.B42 U1.C8
RX7+: F1.B45 U1.D10
RX7-: F1.B46 U1.D9
RX8+: F1.B50 U1.C6
RX8-: F1.B51 U1.C5
RX9+: F1.B54 U1.A6
RX9-: F1.B55 U1.A5
RX10+: F1.B58 U1.B5
RX10-: F1.B59 U1.B4
RX11+: F1.B62 U1.D5
RX11-: F1.B63 U1.D4
RX12+: F1.B66 U1.A3
RX12-: F1.B67 U1.A2
RX13+: F1.B70 U1.B2
RX13-: F1.B71 U1.B1
RX14+: F1.B74 U1.C3
RX14-: F1.B75 U1.C2
RX15+: F1.B78 U1.D2
RX15-: F1.B79 U1.D1
SXM_PRSNT2: U1.K39
THERM_OVER#: H3.2 U1.A19
TX0+: C61.2 U1.J13
TX0-: C62.2 U1.J12
TX1+: C1.2 U1.G13
TX1-: C2.2 U1.G12
TX2+: C3.2 U1.H12
TX2-: C4.2 U1.H11
TX3+: C5.2 U1.K12
TX3-: C6.2 U1.K11
TX4+: C7.2 U1.G10
TX4-: C8.2 U1.G9
TX5+: C9.2 U1.H9
TX5-: C10.2 U1.H8
TX6+: C11.2 U1.J10
TX6-: C12.2 U1.J9
TX7+: C13.2 U1.K9
TX7-: C14.2 U1.K8
TX8+: C15.2 U1.K6
TX8-: C16.2 U1.K5
TX9+: C17.2 U1.H6
TX9-: C18.2 U1.H5
TX10+: C19.2 U1.G5
TX10-: C20.2 U1.G4
TX11+: C21.2 U1.J5
TX11-: C22.2 U1.J4
TX12+: C23.2 U1.H3
TX12-: C24.2 U1.H2
TX13+: C25.2 U1.G2
TX13-: C26.2 U1.G1
TX14+: C27.2 U1.J2
TX14-: C28.2 U1.J1
TX15+: C29.2 U1.K3
TX15-: C30.2 U1.K2

Pads without a net: F1 A5 A6 A7 A8 A19 A32 A33 A50 B5 B6 B9 B10 B11 B12 B30 B82; U1 A15 A16 B16 B17 C15 C16 D16 D17 G16 G17 H15 H16 J16 J17 K15 K16; U9 MH2 MH3 MH6 MH7

## Via types
v1: diameter 0.45, hole 0.299, Top Layer to Bottom Layer, 365 vias

## Routing (per net, layer and track width the routed paths; a pad name or vN(x,y) marks a point on that pad's centre or on a via; arc(x,y) is an arc through that point)
+1V8: length 8.3
  Bottom Layer w0.254: 6.54,76.51 6.79,76.51 arc(7.58,76.67) 8.26,77.12 ; 8.32,77.16 8.55,77.16 arc(9.18,77.29) 9.71,77.65 arc(10.1,78.22) 10.23,78.9 10.23,81.09 arc(10.11,81.72) 9.75,82.26
+5V: length 32.2
  Top Layer w0.508: 83.29,51.26 88.33,51.26 arc(88.42,51.24) 88.5,51.19
  Bottom Layer w0.254: 6.54,75.13 7.03,75.13 arc(7.71,75.27) 8.29,75.65 ; 8.3,75.55 8.96,74.88 arc(9.11,74.67) 9.16,74.42 9.16,72.23 arc(8.96,71.25) 8.41,70.43 4.8,66.82 arc(4.31,66.08) 4.14,65.21 4.14,56.2 arc(4.33,55.23) 4.88,54.41 5.95,53.34
  vias: v1(8.85,53.5) v1(11.11,53.49) v1(13.08,54.04) v1(13.1,53.03) v1(14.12,54.03) v1(14.17,53.09) v1(83.35,51.2) v1(85.89,51.23)
+12V: length 148.7
  Top Layer w0.508: 76.96,66.37 88.35,66.37 arc(88.36,66.37) 88.37,66.38 ; 77,53.74 88.32,53.74 arc(88.41,53.72) 88.48,53.67 ; 76.96,57.51 88.28,57.51 arc(88.33,57.5) 88.37,57.47 ; 88.39,58.73 77.06,58.73 arc(77.01,58.74) 76.97,58.77 ; 88.37,68.92 76.99,68.92 ; 88.39,65.09 76.98,65.09 ; 88.47,76.54 77,76.54 arc(76.98,76.54) 76.97,76.55 ; 88.4,54.95 77,54.95 arc(76.99,54.95) 76.98,54.96 ; 76.98,73.97 88.33,73.97 arc(88.37,73.97) 88.4,74 ; 88.4,62.57 76.99,62.57 arc(76.98,62.57) 76.97,62.56 ; 76.96,61.3 88.35,61.3 arc(88.37,61.29) 88.39,61.28 ; 77,72.73 88.37,72.73 arc(88.4,72.74) 88.42,72.75 ; 88.4,70.2 77.06,70.2 arc(77,70.19) 76.95,70.16
  vias: v1(2.97,60.44) v1(3.06,57.98) v1(4.52,20.42) v1(4.62,22.18) v1(6.23,61.01) v1(9.93,61.1) v1(10.09,9.86) v1(10.09,9.1) v1(10.09,8.34) v1(10.09,7.58) v1(10.85,9.86) v1(10.85,9.1) v1(10.85,8.34) v1(10.85,7.58) v1(34.94,81) v1(45.09,81) v1(55.14,80.82) v1(65.29,80.73) v1(76.98,76.55) v1(76.94,73.96) v1(76.98,72.7) v1(76.97,70.2) v1(76.95,68.89) v1(76.95,66.43) v1(76.96,65.09) v1(76.93,62.59) v1(76.97,61.27) v1(76.95,58.77) v1(76.96,57.4) v1(76.96,54.91) v1(76.97,53.73) v1(88.38,74) v1(88.38,66.41) v1(88.41,62.53) v1(88.41,58.78) v1(88.41,57.49) v1(88.41,53.65) v1(88.42,76.52) v1(88.42,72.77) v1(88.42,70.18) v1(88.42,68.89) v1(88.42,65.1) v1(88.42,61.28) v1(88.44,54.94)
GND: length 306.4
  Top Layer w0.254: 85.85,43.57 85.87,42.32 ; 22.53,6.37 22.7,6.19 arc(22.94,5.83) 23.03,5.4 23.03,5.33 ; 80.8,39.76 82.08,39.72 ; 82.11,33.34 82.11,33.32 ; 82.11,33.32 82.05,27.03 ; 82.11,33.32 80.81,33.31 80.72,35.83 ; 88.45,60.07 76.96,60.04 ; 90.12,5.34 90.12,5.91 arc(90.02,6.42) 89.74,6.85 ; 84.6,48.57 83.27,47.31 ; 83.02,5.46 83.02,5.82 arc(83.11,6.29) 83.37,6.68 ; 79.55,38.47 80.74,39.74 ; 76.95,34.67 79.41,34.67 arc(79.57,34.64) 79.7,34.55 ; 87.06,5.33 87.06,6.08 arc(87.14,6.47) 87.36,6.8 ; 83.28,43.62 83.29,43.61 ; 83.29,43.61 87.12,43.56 ; 83.29,43.61 83.31,44.91 ; 78.13,48.63 76.95,47.38 ; 78.13,48.63 78.11,48.65 ; 78.13,48.63 79.4,47.43 80.81,48.59 80.79,49.9 84.6,49.91 ; 45.07,5.23 45.07,5.44 arc(44.93,6.13) 44.54,6.71 ; 87.19,48.64 87.14,48.59 ; 87.14,48.59 88.39,47.35 arc(88.4,47.34) 88.4,47.33 ; 87.14,48.59 87.11,48.63 ; 87.14,48.59 85.88,47.33 arc(85.85,47.31) 85.81,47.3 ; 88.45,63.87 76.99,63.87 ; 84.6,49.91 88.41,49.93 ; 84.6,49.91 84.6,48.7 ; 84.6,49.91 84.6,49.97 ; 87.04,35.99 88.44,34.63 87.14,33.35 85.87,34.64 ; 78.07,5.33 78.07,5.46 arc(77.93,6.14) 77.55,6.71 ; 87.14,44.77 87.12,43.57 ; 32.09,5.22 32.09,5.92 arc(32.19,6.38) 32.45,6.78 ; 78.24,43.54 82,43.54 82.03,41 ; 84.68,33.42 84.6,34.65 ; 42.08,5.4 42.08,5.65 arc(42.19,6.24) 42.53,6.75 ; 45.99,5.4 45.99,5.44 arc(46.13,6.14) 46.53,6.74 ; 76.98,34.58 76.66,34.89 arc(76.03,35.03) 75.5,35.39 74.65,36.24 arc(73.99,36.67) 73.22,36.83 70.27,36.83 arc(69.3,36.63) 68.48,36.08 68.19,35.8 ; 82.08,46.18 82.08,43.48 ; 78.2,49.88 78.18,48.68 ; 36.42,6.6 36.47,6.65 arc(36.49,6.68) 36.5,6.72 ; 74.98,5.33 74.98,5.61 arc(75.1,6.22) 75.44,6.74 ; 82.11,5.34 82.11,5.82 arc(82.01,6.33) 81.72,6.76 ; 83.31,30.83 83.32,29.57 ; 83.32,29.57 U1.F2 83.33,26.97 ; 83.32,29.57 84.46,29.57 ; 83.32,29.57 83.29,29.57 ; 82.07,35.82 80.72,35.83 ; 80.72,35.83 80.72,35.87 ; 80.75,29.62 81.71,29.62 arc(81.86,29.59) 81.98,29.51 ; 81.97,44.8 80.72,44.89 ; 88.5,52.39 U1.E21 76.83,52.44 ; 73.5,6.76 73.52,6.74 arc(73.95,6.1) 74.1,5.35 ; 83.31,44.91 84.62,44.86 ; 83.31,44.91 83.24,44.91 ; 70.01,5.35 70.01,5.98 arc(69.93,6.4) 69.7,6.75 ; 78.21,43.67 78.24,44.97 ; 28.16,5.43 28.16,6.1 arc(28.09,6.48) 27.87,6.8 ; 87.12,39.76 88.41,38.46 ; 83.36,33.35 83.36,33.34 ; 83.36,33.34 83.36,32.13 ; 83.36,33.34 84.6,33.35 ; 53.1,5.28 53.1,5.49 arc(52.96,6.19) 52.56,6.79 ; 83.34,39.73 84.59,39.74 85.87,38.51 ; 25.43,6.85 25.53,6.74 arc(25.94,6.12) 26.09,5.39 ; 76.93,75.29 87.14,75.29 ; 83.36,35.95 83.3,43.54 ; 83.36,35.95 83.36,35.87 ; 83.36,35.95 84.67,35.97 ; 88.44,56.23 76.94,56.28 ; 31.04,5.11 31.04,5.89 arc(30.95,6.38) 30.67,6.8 ; 84.65,34.64 85.89,34.65 ; 71.02,5.36 71.02,5.57 arc(71.15,6.18) 71.49,6.7 ; 83.33,32.06 83.3,30.8 ; 83.31,26.97 82.07,27.03 ; 88.36,67.67 76.99,67.68 ; 87.09,49.85 87.09,48.65 ; 79.12,5.36 79.12,6 arc(79.19,6.37) 79.4,6.68 ; 86.06,5.34 86.06,5.77 arc(85.96,6.3) 85.66,6.74 ; 35.11,5.28 35.11,5.81 arc(35,6.33) 34.71,6.77 ; 85.75,25.69 85.99,25.69 arc(86.07,25.7) 86.13,25.75 86.24,25.85 arc(86.35,26.02) 86.39,26.21 arc(86.32,26.55) 86.12,26.84 85.87,27.1 ; 66.97,5.41 66.97,5.6 arc(67.09,6.21) 67.44,6.73 ; 83.35,47.36 83.31,44.91 ; 82.01,47.43 83.26,47.3 83.26,47.29 ; 84.58,29.48 85.7,30.6 arc(85.79,30.73) 85.82,30.88 ; 50.01,5.41 50.01,5.66 arc(50.13,6.25) 50.47,6.76 ; 57.08,5.41 57.08,5.62 arc(56.96,6.24) 56.6,6.77 ; 85.9,38.45 87.12,39.77 ; 88.48,71.5 76.93,71.5 ; 62.01,5.35 62.01,5.75 arc(61.89,6.3) 61.58,6.78 ; 39.06,5.41 39.06,5.94 arc(38.98,6.34) 38.75,6.68 ; 82.07,35.83 82.09,39.7 ; 87.06,29.51 85.95,30.63 arc(85.87,30.74) 85.85,30.88 ; 76.95,43.54 78.21,43.54 ; 77.1,25.63 76.91,25.81 arc(76.77,26.02) 76.72,26.27 76.72,26.4 arc(76.79,26.75) 76.99,27.04 ; 87.15,29.44 88.3,30.59 arc(88.37,30.68) 88.39,30.79 ; 83.18,35.95 83.36,35.95 ; 66.06,5.45 66.06,5.75 arc(65.95,6.32) 65.62,6.81 ; 54.02,5.36 54.02,5.65 arc(54.14,6.24) 54.47,6.75 ; 88.37,43.53 88.34,42.25 ; 63.12,5.42 63.12,5.8 arc(63.21,6.28) 63.48,6.69 ; 36.04,5.45 36.04,5.62 arc(36.15,6.17) 36.46,6.63 ; 49.03,5.32 49.03,5.63 arc(48.91,6.27) 48.55,6.81 ; 58.96,5.32 58.96,6.18 arc(59.03,6.5) 59.21,6.78 ; 87.14,43.59 88.43,43.55
  Bottom Layer w0.254: 89.73,6.79 89.44,6.5 arc(89.1,5.99) 88.98,5.38 ; 38.7,6.82 38.56,6.69 arc(38.18,6.11) 38.05,5.44 ; 92.08,5.21 92.08,6.13 arc(92.07,6.19) 92.04,6.23 ; 72.03,5.44 72.03,5.67 arc(71.91,6.27) 71.57,6.78 ; 81.63,6.76 81.54,6.68 arc(81.15,6.08) 81.01,5.38 ; 65.67,6.87 65.6,6.8 arc(65.21,6.22) 65.07,5.53 ; 87.28,6.85 87.61,6.52 arc(87.94,6.03) 88.05,5.46 ; 79.45,6.78 79.59,6.64 arc(79.95,6.1) 80.07,5.47 ; 6.76,78 7.52,78 arc(7.97,78.09) 8.35,78.34 ; 52,5.4 52,5.46 arc(52.15,6.2) 52.57,6.82 ; 77.56,6.75 77.55,6.74 arc(77.14,6.12) 76.99,5.4 ; 63.53,6.82 63.59,6.76 arc(63.99,6.16) 64.13,5.44 ; 28.16,5.44 28.16,6.19 arc(28.09,6.56) 27.88,6.87 ; 55.1,5.32 55.1,5.37 arc(54.95,6.11) 54.53,6.74 ; 69.62,6.81 69.48,6.67 arc(69.12,6.13) 69,5.5 ; 51.07,5.46 51.07,5.65 arc(50.94,6.27) 50.59,6.79 ; 73.1,5.38 73.1,5.95 arc(73.18,6.37) 73.43,6.74 ; 34.77,6.82 34.5,6.55 arc(34.15,6.03) 34.03,5.41 ; 25.11,5.46 25.11,6.14 arc(25.19,6.52) 25.41,6.85 ; 85.08,5.46 85.08,5.48 arc(85.24,6.25) 85.68,6.91 ; 41.15,5.43 41.15,5.81 arc(41.22,6.16) 41.42,6.45 arc(41.88,6.76) 42.42,6.87 42.53,6.87 ; 85.84,47.77 85.84,47.38 arc(85.84,47.36) 85.85,47.35 ; 59.02,5.41 59.02,6.51 arc(59.05,6.66) 59.14,6.79 ; 84.03,5.46 84.03,5.47 arc(83.88,6.21) 83.46,6.84 ; 30.6,6.79 30.59,6.79 arc(30.16,6.14) 30,5.37 ; 47.08,5.34 47.08,5.59 arc(46.94,6.3) 46.53,6.91 ; 37.05,5.43 37.05,5.47 arc(36.9,6.21) 36.48,6.84 ; 75.52,6.81 75.53,6.81 arc(75.93,6.2) 76.07,5.49 ; 61.68,6.78 61.53,6.63 arc(61.19,6.12) 61.07,5.52 ; 33.02,5.22 33.02,5.42 arc(32.88,6.14) 32.47,6.75 ; 67.44,6.79 67.67,6.56 arc(67.96,6.13) 68.06,5.62 ; 56.69,6.69 56.59,6.59 arc(56.17,5.96) 56.02,5.22 ; 48.03,5.43 48.03,5.67 arc(48.15,6.26) 48.48,6.75 ; 79.52,47.62 79.52,47.31 arc(79.51,47.3) 79.51,47.29 ; 44.59,6.82 arc(44.19,6.23) 44.05,5.53
  vias: v1(5.44,97.34) v1(5.44,92.26) v1(5.44,71.94) v1(5.44,41.46) v1(5.44,36.38) v1(5.44,31.3) v1(5.44,26.22) v1(5.44,16.06) v1(5.62,46.33) v1(6.32,55.96) v1(8.37,78.24) v1(8.38,74.46) v1(10.03,55.9) v1(10.52,97.34) v1(10.52,92.26) v1(10.52,87.18) v1(10.52,82.1) v1(10.52,77.02) v1(10.52,71.94) v1(10.52,66.86) v1(10.52,46.54) v1(10.52,41.46) v1(10.52,36.38) v1(10.52,31.3) v1(10.52,26.22) v1(10.52,21.14) v1(10.52,16.06) v1(15.6,97.34) v1(15.6,92.26) v1(15.6,77.02) v1(15.6,71.94) v1(15.6,66.86) v1(15.6,61.78) v1(15.6,56.7) v1(15.6,51.62) v1(15.6,46.54) v1(15.6,41.46) v1(15.6,36.38) v1(15.6,31.3) v1(15.6,26.22) v1(15.6,10.98) v1(20.68,97.34) v1(20.68,92.26) v1(20.68,82.1) v1(20.68,77.02) v1(20.68,71.94) v1(20.68,66.86) v1(20.68,61.78) v1(20.68,56.7) v1(20.68,51.62) v1(20.68,46.54) v1(20.68,41.46) v1(20.68,36.38) v1(20.68,31.3) v1(20.68,26.22) v1(20.68,21.14) v1(20.68,10.98) v1(22.41,6.42) v1(25.47,6.84) v1(25.76,97.34) v1(25.76,92.26) v1(25.76,87.18) v1(25.76,82.1) v1(25.76,77.02) v1(25.76,71.94) v1(25.76,66.86) v1(25.76,61.78) v1(25.76,56.7) v1(25.76,51.62) v1(25.76,46.54) v1(25.76,41.46) v1(25.76,36.38) v1(25.76,31.3) v1(25.76,26.22) v1(27.86,6.83) v1(30.63,6.82) v1(30.84,97.34) v1(30.84,92.26) v1(30.84,87.18) v1(30.84,82.1) v1(30.84,77.02) v1(30.84,71.94) v1(30.84,66.86) v1(30.84,61.78) v1(30.84,56.7) v1(30.84,51.62) v1(30.84,46.54) v1(30.84,41.46) v1(30.84,36.38) v1(30.84,31.3) v1(32.47,6.82) v1(34.75,6.79) v1(35.12,75.49) v1(35.92,97.34) v1(35.92,92.26) v1(35.92,87.18) v1(35.92,77.02) v1(35.92,71.94) v1(35.92,66.86) v1(35.92,61.78) v1(35.92,56.7) v1(35.92,51.62) v1(35.92,46.54) v1(35.92,41.46) v1(35.92,36.38) v1(36.45,6.79) v1(38.73,6.76) v1(41,97.34) v1(41,92.26) v1(41,87.18) v1(41,82.1) v1(41,77.02) v1(41,71.94) v1(41,66.86) v1(41,61.78) v1(41,56.7) v1(41,51.62) v1(41,46.54) v1(41,41.46) v1(42.55,6.82) v1(44.54,6.82) v1(45.16,75.59) v1(46.08,92.26) v1(46.08,87.18) v1(46.08,82.1) v1(46.08,77.02) v1(46.08,71.94) v1(46.08,61.78) v1(46.08,56.7) v1(46.08,51.62) v1(46.08,46.54) v1(46.56,6.82) v1(48.57,6.8) v1(50.5,6.82) v1(51.16,92.26) v1(51.16,87.18) v1(51.16,82.1) v1(51.16,77.02) v1(51.16,71.94) v1(51.16,66.86) v1(51.16,56.7) v1(51.16,51.62) v1(52.6,6.82) v1(54.49,6.8) v1(55.24,75.49) v1(56.24,97.34) v1(56.24,92.26) v1(56.24,87.18) v1(56.24,82.1) v1(56.24,77.02) v1(56.24,71.94) v1(56.24,66.86) v1(56.24,61.78) v1(56.24,51.62) v1(56.67,6.77) v1(59.21,6.79) v1(61.32,97.34) v1(61.32,92.26) v1(61.32,87.18) v1(61.32,82.1) v1(61.32,77.02) v1(61.32,71.94) v1(61.32,66.86) v1(61.32,61.78) v1(61.32,56.7) v1(61.6,6.79) v1(63.56,6.77) v1(65.28,75.54) v1(65.63,6.76) v1(66.4,92.26) v1(66.4,87.18) v1(66.4,82.1) v1(66.4,77.02) v1(66.4,71.94) v1(66.4,66.86) v1(66.4,61.78) v1(66.4,56.7) v1(66.4,51.62) v1(67.47,6.76) v1(68.15,35.78) v1(69.62,6.76) v1(71.48,97.34) v1(71.48,92.26) v1(71.48,87.18) v1(71.48,82.1) v1(71.48,77.02) v1(71.48,71.94) v1(71.48,66.86) v1(71.48,61.78) v1(71.48,56.7) v1(71.48,51.62) v1(71.57,6.76) v1(73.46,6.77) v1(75.45,6.77) v1(76.56,97.34) v1(76.56,92.26) v1(76.56,87.18) v1(76.56,82.1) v1(76.91,60.08) v1(77,75.32) v1(77.02,63.92) v1(76.96,56.23) v1(76.96,42.29) v1(76.95,38.44) v1(77.03,71.5) v1(77.05,67.73) v1(77.03,30.76) v1(77.11,25.63) v1(77.56,6.75) v1(78.11,33.43) v1(78.21,44.81) v1(78.25,39.75) v1(78.23,35.92) v1(78.28,29.47) v1(79.4,27.18) v1(79.4,6.76) v1(79.5,47.36) v1(79.53,42.23) v1(79.53,30.72) v1(81.64,97.34) v1(81.64,92.26) v1(81.71,6.76) v1(82.03,75.35) v1(82.09,71.53) v1(82.09,67.62) v1(82.04,63.82) v1(82.06,60.04) v1(82.04,56.22) v1(82.06,52.4) v1(82.03,35.91) v1(82.08,33.38) v1(83.27,33.34) v1(83.35,52.42) v1(83.35,35.9) v1(83.42,6.76) v1(85.68,6.77) v1(85.73,25.69) v1(85.88,52.44) v1(85.87,47.38) v1(86.72,97.34) v1(86.72,92.26) v1(86.72,82.1) v1(87.15,44.81) v1(87.12,29.55) v1(87.33,6.79) v1(88.41,67.67) v1(88.41,60.05) v1(88.41,56.2) v1(88.42,71.46) v1(88.42,63.85) v1(88.5,42.24) v1(88.42,26.97) v1(89.77,6.79) v1(91.8,97.34) v1(91.8,92.26) v1(91.8,87.18) v1(91.8,82.1) v1(91.8,77.02) v1(91.8,71.94) v1(91.8,66.86) v1(91.8,61.78) v1(91.8,56.7) v1(91.8,51.62) v1(91.8,46.54) v1(91.8,41.46) v1(91.8,36.38) v1(91.8,31.3) v1(91.8,26.22) v1(92.1,6.18)
ADJ: length 5.4
  Bottom Layer w0.254: 5.64,49.95 6.61,46.54 ; 6.97,50.98 8.77,50.96
CLK+: length 97.1
  Top Layer w0.132: U1.F7 83.27,34.64 arc(82.95,34.77) 82.82,35.09 82.82,35.22 arc(82.82,35.22) 82.82,35.22 arc(82.82,35.22) 82.82,35.22 82.82,46.11 arc(82.61,46.6) 82.12,46.8 51.49,46.8 arc(50.52,46.61) 49.69,46.06 24.15,20.52 arc(23.6,19.69) 23.41,18.72 23.41,8.68 arc(23.32,8.24) v1(23.07,7.87)
  Bottom Layer w0.132: 23.04,5.48 23.08,5.52 arc(23.31,5.87) 23.4,6.28 23.4,7.08 arc(23.31,7.51) v1(23.07,7.87)
CLK-: length 97.2
  Top Layer w0.132: U1.E7 82.18,34.64 arc(82.46,34.75) 82.58,35.04 82.58,35.17 arc(82.58,35.17) 82.58,35.17 arc(82.58,35.17) 82.59,35.17 82.59,46.11 arc(82.45,46.43) 82.12,46.57 51.49,46.57 arc(50.61,46.39) 49.86,45.89 31.2,27.24 31.2,27.1 31.27,27.04 31.27,26.91 31.13,26.77 31,26.77 30.93,26.83 30.8,26.83 30.66,26.7 30.66,26.56 30.73,26.5 30.73,26.37 30.59,26.23 30.46,26.23 30.39,26.3 30.26,26.3 24.32,20.35 arc(23.82,19.61) 23.64,18.72 23.64,8.64 arc(23.73,8.21) v1(23.98,7.83)
  Bottom Layer w0.132: v1(23.98,7.83) 23.94,7.8 arc(23.72,7.47) 23.65,7.09 23.65,6.48 arc(23.76,5.92) 24.07,5.46
I2CADDR0:
  vias: v1(85.86,48.6)
I2CADDR1:
  vias: v1(79.49,48.61)
PCIET0+: length 3.5
  Bottom Layer w0.127: 26.01,8.8 26.01,8.3 arc(26.06,8.04) 26.21,7.82 arc(26.32,7.66) 26.36,7.47 26.36,6.24 arc(26.29,5.92) 26.11,5.65 25.98,5.51
PCIET0-: length 3.5
  Bottom Layer w0.127: 27.02,8.76 27.02,8.33 arc(26.96,8.02) 26.78,7.75 arc(26.64,7.55) 26.59,7.3 26.59,6.22 arc(26.65,5.93) 26.82,5.68 26.97,5.52
PCIET1+: length 3.4
  Bottom Layer w0.127: 31.02,8.78 31.02,8.08 arc(31.06,7.93) 31.14,7.79 arc(31.33,7.51) 31.4,7.17 31.4,6.39 arc(31.31,5.95) 31.06,5.57
PCIET1-: length 3.4
  Bottom Layer w0.127: 32.03,8.69 32.03,8.2 arc(31.97,7.94) 31.83,7.72 arc(31.68,7.5) 31.63,7.25 31.63,6.31 arc(31.72,5.86) 31.98,5.47
PCIET2+: length 3.3
  Bottom Layer w0.127: 34.99,8.71 34.99,8.5 arc(35.06,8.14) 35.27,7.83 arc(35.38,7.67) 35.41,7.47 35.41,6.51 arc(35.31,6) 35.03,5.57
PCIET2-: length 3.2
  Bottom Layer w0.127: 36.04,8.65 36.04,8.45 arc(35.98,8.13) 35.79,7.85 arc(35.71,7.73) 35.68,7.59 35.68,6.31 arc(35.76,5.92) 35.98,5.6 35.98,5.59
PCIET3+: length 3.2
  Bottom Layer w0.127: 38.94,8.57 38.94,8.41 arc(39.01,8.07) 39.2,7.79 arc(39.32,7.6) 39.36,7.39 39.36,6.38 arc(39.27,5.93) 39.02,5.55
PCIET3-: length 3.4
  Bottom Layer w0.127: 40.06,8.77 40.06,8.37 arc(39.98,8) 39.78,7.7 arc(39.71,7.59) 39.69,7.47 39.69,6.18 arc(39.74,5.89) 39.9,5.66 39.99,5.57
PCIET4+: length 3.2
  Bottom Layer w0.127: 45.04,5.54 45.04,5.6 arc(45.29,5.98) 45.37,6.42 45.37,7.2 arc(45.32,7.45) 45.18,7.67 arc(45.06,7.85) 45.02,8.06 45.02,8.59
PCIET4-: length 3.6
  Bottom Layer w0.127: 46.06,8.76 46.06,8.36 arc(45.98,7.98) 45.77,7.66 arc(45.72,7.59) 45.7,7.5 45.7,6.46 arc(45.78,6.04) 46.02,5.69 46.24,5.47
PCIET5+: length 3.5
  Bottom Layer w0.127: 48.94,5.51 48.95,5.52 arc(49.31,6.05) 49.44,6.69 49.44,7.4 arc(49.39,7.63) 49.26,7.83 arc(49.08,8.09) 49.02,8.41 49.02,8.72
PCIET5-: length 3.4
  Bottom Layer w0.127: 50.02,8.74 50.02,8.23 arc(49.96,7.96) 49.81,7.73 arc(49.72,7.6) 49.69,7.44 49.69,6.34 arc(49.78,5.89) 50.03,5.51
PCIET6+: length 3.4
  Bottom Layer w0.127: 53.08,8.71 53.08,8.11 arc(53.13,7.84) 53.29,7.61 arc(53.41,7.43) 53.45,7.21 53.45,6.49 arc(53.34,5.94) 53.03,5.48
PCIET6-: length 3.6
  Bottom Layer w0.127: 54.04,8.74 54.04,8.04 arc(53.99,7.75) 53.82,7.5 arc(53.76,7.41) 53.73,7.29 53.73,6.27 arc(53.83,5.76) 54.12,5.33
PCIET7+: length 3.4
  Bottom Layer w0.127: 57.02,8.78 57.02,8.46 arc(57.08,8.17) 57.24,7.92 arc(57.41,7.67) 57.46,7.38 57.46,6.3 arc(57.39,5.92) 57.17,5.59
PCIET7-: length 3.5
  Bottom Layer w0.127: 58.07,8.75 58.07,8.28 arc(58.03,8.04) 57.89,7.85 arc(57.8,7.7) 57.77,7.53 57.77,6.16 arc(57.85,5.76) 58.07,5.42
PCIET8+: length 3.4
  Bottom Layer w0.127: 61.96,8.68 61.96,8.4 arc(62.02,8.09) 62.19,7.83 arc(62.37,7.57) 62.43,7.25 62.43,6.43 arc(62.35,6.01) 62.1,5.65 62.03,5.57
PCIET8-: length 3.3
  Bottom Layer w0.127: 63.1,5.51 62.99,5.62 arc(62.77,5.94) 62.7,6.33 62.7,7.43 arc(62.74,7.62) 62.85,7.78 arc(62.99,8) 63.04,8.25 63.04,8.63
PCIET9+: length 3.5
  Bottom Layer w0.127: 65.92,5.49 65.96,5.52 arc(66.26,5.98) 66.37,6.52 66.37,7.32 arc(66.33,7.51) 66.22,7.68 arc(66.07,7.91) 66.01,8.18 66.01,8.78
PCIET9-: length 3.5
  Bottom Layer w0.127: 67.03,8.77 67.03,8.18 arc(66.97,7.88) 66.81,7.63 arc(66.69,7.45) 66.65,7.24 66.65,6.49 arc(66.76,5.95) 67.06,5.49
PCIET10+: length 3.5
  Bottom Layer w0.127: 70.04,8.82 70.04,8.41 arc(70.1,8.07) 70.29,7.78 arc(70.41,7.61) 70.45,7.4 70.45,6.74 arc(70.32,6.09) 69.96,5.55
PCIET10-: length 3.3
  Bottom Layer w0.127: 71.1,8.76 71.1,8.22 arc(71.05,7.96) 70.9,7.75 arc(70.82,7.62) 70.79,7.48 70.79,6.33 arc(70.87,5.93) 71.1,5.59
PCIET11+: length 3.5
  Bottom Layer w0.127: 74.01,8.76 74.01,8.25 arc(74.06,8.01) 74.19,7.81 arc(74.31,7.63) 74.36,7.41 74.36,6.42 arc(74.25,5.89) 73.95,5.44
PCIET11-: length 3.4
  Bottom Layer w0.127: 75.04,8.73 75.04,8.35 arc(74.97,8) 74.77,7.71 arc(74.69,7.57) 74.66,7.42 74.66,6.41 arc(74.75,5.94) 75.01,5.55
PCIET12+: length 3.4
  Bottom Layer w0.127: 78.06,8.76 78.06,8.1 arc(78.1,7.92) 78.2,7.77 arc(78.35,7.55) 78.4,7.29 78.4,6.31 arc(78.32,5.93) 78.11,5.61 78.06,5.56 arc(78.05,5.56) 78.04,5.56
PCIET12-: length 3.6
  Bottom Layer w0.127: 79.1,5.47 79.01,5.56 arc(78.73,5.97) 78.63,6.46 78.63,7 arc(78.71,7.41) 78.94,7.75 arc(79.02,7.86) 79.04,7.99 79.04,8.78
PCIET13+: length 3.5
  Bottom Layer w0.127: 82.03,8.8 82.03,8.23 arc(82.08,7.98) 82.22,7.78 arc(82.38,7.53) 82.44,7.25 82.44,6.55 arc(82.33,6.01) 82.02,5.55
PCIET13-: length 3.5
  Bottom Layer w0.127: 83.03,8.77 83.03,8.1 arc(83.01,7.97) 82.94,7.86 arc(82.77,7.62) 82.72,7.34 82.72,6.25 arc(82.8,5.84) 83.03,5.49
PCIET14+: length 3.7
  Bottom Layer w0.127: 86.03,8.72 86.03,8.09 arc(86.09,7.81) 86.25,7.57 arc(86.37,7.39) 86.41,7.18 86.41,6.2 arc(86.35,5.91) 86.18,5.66 85.87,5.35
PCIET14-: length 3.3
  Bottom Layer w0.127: 87.02,8.74 87.02,7.99 arc(86.98,7.78) 86.86,7.61 arc(86.7,7.36) 86.65,7.08 86.65,6.31 arc(86.72,5.92) 86.94,5.59
PCIET15+: length 3.3
  Bottom Layer w0.127: 90.02,8.59 90.02,8.2 arc(90.08,7.89) 90.26,7.62 arc(90.38,7.43) 90.43,7.22 90.43,6.6 arc(90.31,6.01) 89.97,5.5
PCIET15-: length 3.5
  Bottom Layer w0.127: 91.11,5.5 91.04,5.57 arc(90.76,5.99) 90.66,6.48 90.66,7.16 arc(90.72,7.45) 90.88,7.69 arc(91,7.87) 91.04,8.07 91.04,8.78
PERST#: length 88.6
  Bottom Layer w0.254: 19.01,5.25 19.01,10.1 arc(19.07,10.41) 19.25,10.67 22.07,13.5 arc(22.63,14.32) 22.82,15.29 22.82,16.79 arc(23.01,17.76) 23.56,18.58 48.05,43.07 arc(48.87,43.62) 49.84,43.81 80.56,43.81 arc(81.53,44) 82.36,44.55 82.85,45.05 arc(83.23,45.62) 83.37,46.29 83.37,48.12 arc(83.33,48.31) 83.22,48.48
  vias: v1(83.31,48.58)
PRSNT1: length 6.9
  Bottom Layer w0.254: 9.04,5.3 9.04,9.29 arc(9.23,10.26) 9.78,11.09 10.42,11.72
PRSNT2: length 81.8
  Inner1 w0.254: 91.13,6.28 24.41,6.28 arc(23.9,6.38) 23.48,6.66 19.18,10.96 arc(18.36,11.51) 17.39,11.7 11.42,11.7
  vias: v1(11.4,11.7)
PWR_EN: length 92.1
  Inner1 w0.254: 77.16,48.56 63.28,48.56 arc(62.3,48.76) 61.48,49.31 43.37,67.42 arc(42.81,67.79) 42.16,67.92 23.87,67.92 arc(22.9,68.11) 22.08,68.66 10.49,80.25 5.24,80.25 arc(4.63,80.37) 4.11,80.72 arc(3.68,81.36) 3.53,82.12 3.53,83.77 arc(3.6,84.12) 3.8,84.42 arc(4.25,84.72) 4.77,84.82 5.88,84.82
  vias: v1(76.97,48.61)
RX0+: length 80.9
  Top Layer w0.132: 76.75,43.01 76.53,43.01 arc(75.65,43.19) 74.9,43.69 74.69,43.9 arc(73.94,44.4) 73.06,44.58 53.73,44.58 arc(52.75,44.38) 51.93,43.83 25.29,17.19 arc(24.74,16.37) 24.54,15.39 24.54,6.78 arc(24.44,6.25) 24.14,5.8 23.95,5.61 arc(23.89,5.52) 23.87,5.41 ; 76.75,43.01 79.8,43.01 arc(80.16,42.86) 80.31,42.5 80.31,41.89 arc(80.38,41.73) 80.54,41.66 arc(80.71,41.73) 80.78,41.9 U1.D13 ; 76.75,43.01 arc(76.75,43.02) 76.75,43.02
RX0-: length 80.9
  Top Layer w0.132: U1.D12 80.78,41.19 arc(80.71,41.35) 80.55,41.42 ; 25.17,5.45 25.17,5.46 arc(25.14,5.62) 25.05,5.77 arc(24.85,6.06) 24.78,6.41 24.78,15.39 arc(24.95,16.28) 25.45,17.03 34.8,26.37 34.93,26.37 34.99,26.31 35.13,26.31 35.26,26.45 35.26,26.58 35.2,26.64 35.2,26.77 35.34,26.91 35.47,26.91 35.53,26.85 35.67,26.85 35.8,26.98 35.8,27.12 35.74,27.18 35.74,27.31 52.1,43.67 arc(52.84,44.17) 53.73,44.34 73.06,44.34 arc(73.85,44.19) 74.52,43.74 74.74,43.52 arc(75.56,42.97) 76.53,42.78 79.8,42.78 arc(79.99,42.7) 80.08,42.5 80.08,41.89 arc(80.21,41.56) 80.54,41.43 arc(80.54,41.43) 80.55,41.43
RX1+: length 72
  Top Layer w0.132: U1.B13 78.24,42.02 arc(78.17,41.85) 77.99,41.78 77.86,41.78 arc(77.86,41.78) 77.86,41.78 arc(77.86,41.77) 77.86,41.77 75.8,41.77 arc(75.5,41.83) 75.25,42 75.23,42.02 arc(74.63,42.42) 73.93,42.56 54.84,42.56 arc(53.87,42.37) 53.05,41.82 30.01,18.78 arc(29.46,17.95) 29.26,16.98 29.26,6.27 arc(29.19,5.9) 28.98,5.59
RX1-: length 72
  Top Layer w0.132: U1.B12 78.24,41.31 arc(78.18,41.47) 78.02,41.54 77.89,41.54 arc(77.88,41.54) 77.88,41.54 arc(77.88,41.54) 77.88,41.54 75.8,41.54 arc(75.41,41.62) 75.08,41.84 75.07,41.85 arc(74.54,42.2) 73.93,42.33 54.84,42.33 arc(53.96,42.15) 53.21,41.65 30.17,18.61 arc(29.67,17.86) 29.5,16.98 29.5,6.69 arc(29.58,6.28) 29.81,5.93 29.98,5.76 arc(30.07,5.63) 30.1,5.47
RX2+: length 66.3
  Top Layer w0.132: 32.92,5.53 32.92,5.58 arc(32.93,5.61) 32.94,5.63 arc(33.16,5.95) 33.23,6.32 33.23,17.02 arc(33.42,17.99) 33.97,18.82 55.6,40.44 arc(56.42,40.99) 57.39,41.18 74.49,41.18 arc(74.9,41.1) 75.25,40.87 75.27,40.85 arc(75.67,40.58) 76.14,40.49 76.6,40.49 arc(76.6,40.49) 76.6,40.49 arc(76.61,40.5) 76.61,40.5 76.74,40.5 arc(76.9,40.57) 76.97,40.73 U1.A12
RX2-: length 66.2
  Top Layer w0.132: U1.A11 76.97,40.04 arc(76.91,40.19) 76.76,40.25 76.64,40.25 arc(76.63,40.25) 76.63,40.25 arc(76.62,40.26) 76.62,40.26 76.14,40.26 arc(75.58,40.37) 75.11,40.68 75.09,40.7 arc(74.81,40.89) 74.49,40.95 57.39,40.95 arc(56.51,40.77) 55.76,40.28 34.14,18.65 arc(33.64,17.9) 33.46,17.02 33.46,6.78 arc(33.56,6.28) 33.85,5.86 34,5.7 arc(34.08,5.59) 34.1,5.45
RX3+: length 65.6
  Top Layer w0.132: U1.C12 79.51,40.66 arc(79.46,40.53) 79.33,40.48 ; 36.99,5.42 arc(37.01,5.51) 37.06,5.59 37.12,5.65 arc(37.47,6.17) 37.59,6.78 37.59,17.72 arc(37.78,18.69) 38.33,19.52 58.14,39.33 arc(58.97,39.88) 59.94,40.07 74.5,40.07 arc(75.05,39.96) 75.51,39.65 75.53,39.63 arc(76.01,39.31) 76.58,39.2 78.37,39.2 arc(78.66,39.32) 78.78,39.61 arc(78.78,39.62) 78.78,39.62 78.78,39.92 arc(78.94,40.31) 79.33,40.48
RX3-: length 65.6
  Top Layer w0.132: 38.12,5.42 38.12,5.5 arc(38.1,5.59) 38.05,5.67 arc(37.88,5.92) 37.82,6.22 37.82,17.72 arc(38,18.6) 38.5,19.35 44.79,25.64 44.92,25.64 45.01,25.55 45.14,25.55 45.28,25.69 45.28,25.82 45.19,25.91 45.19,26.04 58.31,39.16 arc(59.06,39.66) 59.94,39.84 74.5,39.84 arc(74.96,39.74) 75.35,39.48 75.36,39.47 arc(75.92,39.1) 76.58,38.97 78.37,38.97 arc(78.82,39.15) 79.01,39.61 arc(79.01,39.62) 79.01,39.62 79.01,39.92 arc(79.11,40.15) 79.34,40.25 arc(79.46,40.2) 79.51,40.07 U1.C11
RX4+: length 58.8
  Top Layer w0.132: U1.B10 78.24,38.19 arc(78.16,37.99) 77.96,37.9 77.83,37.9 ; 77.83,37.9 76.66,37.9 arc(76.46,37.94) 76.29,38.05 75.56,38.78 arc(74.95,39.19) 74.23,39.33 62.72,39.33 arc(61.75,39.14) 60.92,38.59 44.27,21.93 arc(43.72,21.11) 43.52,20.14 43.52,6.76 arc(43.4,6.16) 43.06,5.65 43.03,5.62 arc(42.97,5.53) 42.95,5.43
RX4-: length 58.8
  Top Layer w0.132: 77.82,37.67 76.66,37.67 arc(76.37,37.72) 76.12,37.89 75.4,38.62 arc(74.86,38.97) 74.23,39.1 62.72,39.1 arc(61.84,38.92) 61.09,38.42 48.74,26.07 48.74,25.94 48.85,25.82 48.85,25.69 48.71,25.55 48.58,25.55 48.47,25.67 48.33,25.67 44.43,21.77 arc(43.93,21.02) 43.76,20.14 43.76,6.3 arc(43.83,5.95) 44.02,5.66 44.08,5.6 arc(44.14,5.52) 44.15,5.43 ; U1.B9 78.24,37.37 arc(78.16,37.58) 77.96,37.67 77.83,37.67
RX5+: length 52.4
  Top Layer w0.132: U1.A9 76.97,36.96 arc(76.89,36.76) 76.69,36.67 76.56,36.67 arc(76.55,36.67) 76.55,36.67 arc(76.55,36.67) 76.54,36.66 76.52,36.66 arc(76.42,36.68) 76.34,36.74 75.52,37.56 arc(74.69,38.11) 73.72,38.31 67.05,38.31 arc(66.08,38.11) 65.25,37.56 48.14,20.45 arc(47.59,19.63) 47.4,18.66 47.4,6.47 arc(47.31,6.02) 47.06,5.64 47.01,5.59 arc(46.95,5.5) 46.93,5.4
RX5-: length 52.4
  Top Layer w0.132: U1.A8 76.97,36.15 arc(76.89,36.34) 76.7,36.42 76.57,36.42 arc(76.57,36.42) 76.56,36.43 arc(76.56,36.43) 76.55,36.43 76.52,36.43 arc(76.33,36.47) 76.17,36.58 75.35,37.4 arc(74.6,37.9) 73.72,38.07 67.05,38.07 arc(66.17,37.9) 65.42,37.4 55.47,27.45 55.47,27.32 55.53,27.25 55.53,27.12 55.4,26.98 55.26,26.98 55.2,27.05 55.07,27.05 48.31,20.29 arc(47.81,19.54) 47.63,18.66 47.63,6.67 arc(47.73,6.19) 48,5.79 48.1,5.68 arc(48.18,5.57) 48.21,5.43
RX6+: length 52.3
  Top Layer w0.132: 51.07,5.36 51.07,5.59 arc(51.08,5.62) 51.1,5.66 arc(51.32,5.98) 51.4,6.36 51.4,20.05 arc(51.59,21.02) 52.14,21.84 66.91,36.61 arc(67.73,37.16) 68.71,37.35 73.22,37.35 arc(74.2,37.16) 75.02,36.61 75.87,35.76 arc(76.24,35.51) 76.69,35.42 78.27,35.42 arc(78.61,35.56) 78.75,35.9 78.75,36.21 arc(78.89,36.54) 79.21,36.67 arc(79.42,36.76) 79.51,36.97 U1.C9
RX6-: length 52.3
  Top Layer w0.132: U1.C8 79.51,36.13 arc(79.45,36.3) 79.29,36.39 arc(79.08,36.31) 79,36.1 78.98,35.9 arc(78.78,35.4) 78.27,35.19 76.69,35.19 arc(76.15,35.29) 75.71,35.6 74.85,36.45 arc(74.11,36.94) 73.22,37.12 68.71,37.12 arc(67.82,36.94) 67.07,36.45 59.12,28.49 59.12,28.35 59.16,28.31 59.16,28.18 59.03,28.04 58.89,28.04 58.85,28.09 58.71,28.09 52.31,21.68 arc(51.81,20.93) 51.63,20.05 51.63,6.64 arc(51.73,6.14) 52.01,5.72 52.14,5.59 arc(52.23,5.45) 52.26,5.29
